# EAGLE design NervousSys_V2 (EAGLE 8.6.0)
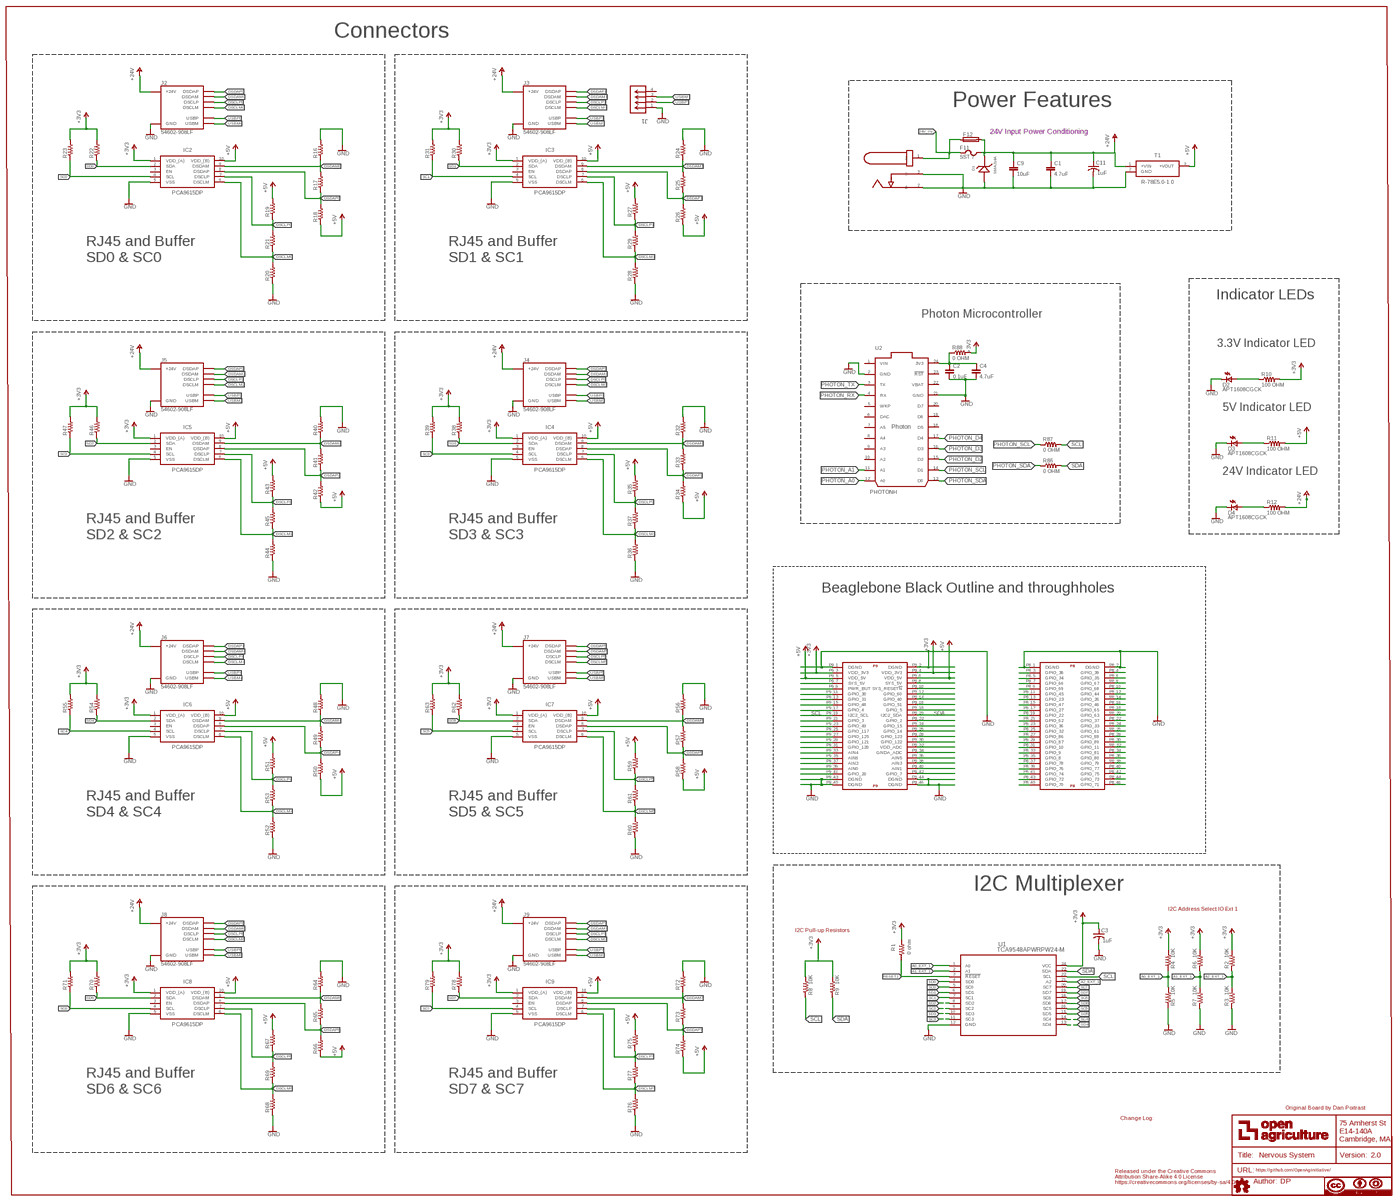
[diagram p0: schematic, sheet 1, overview]
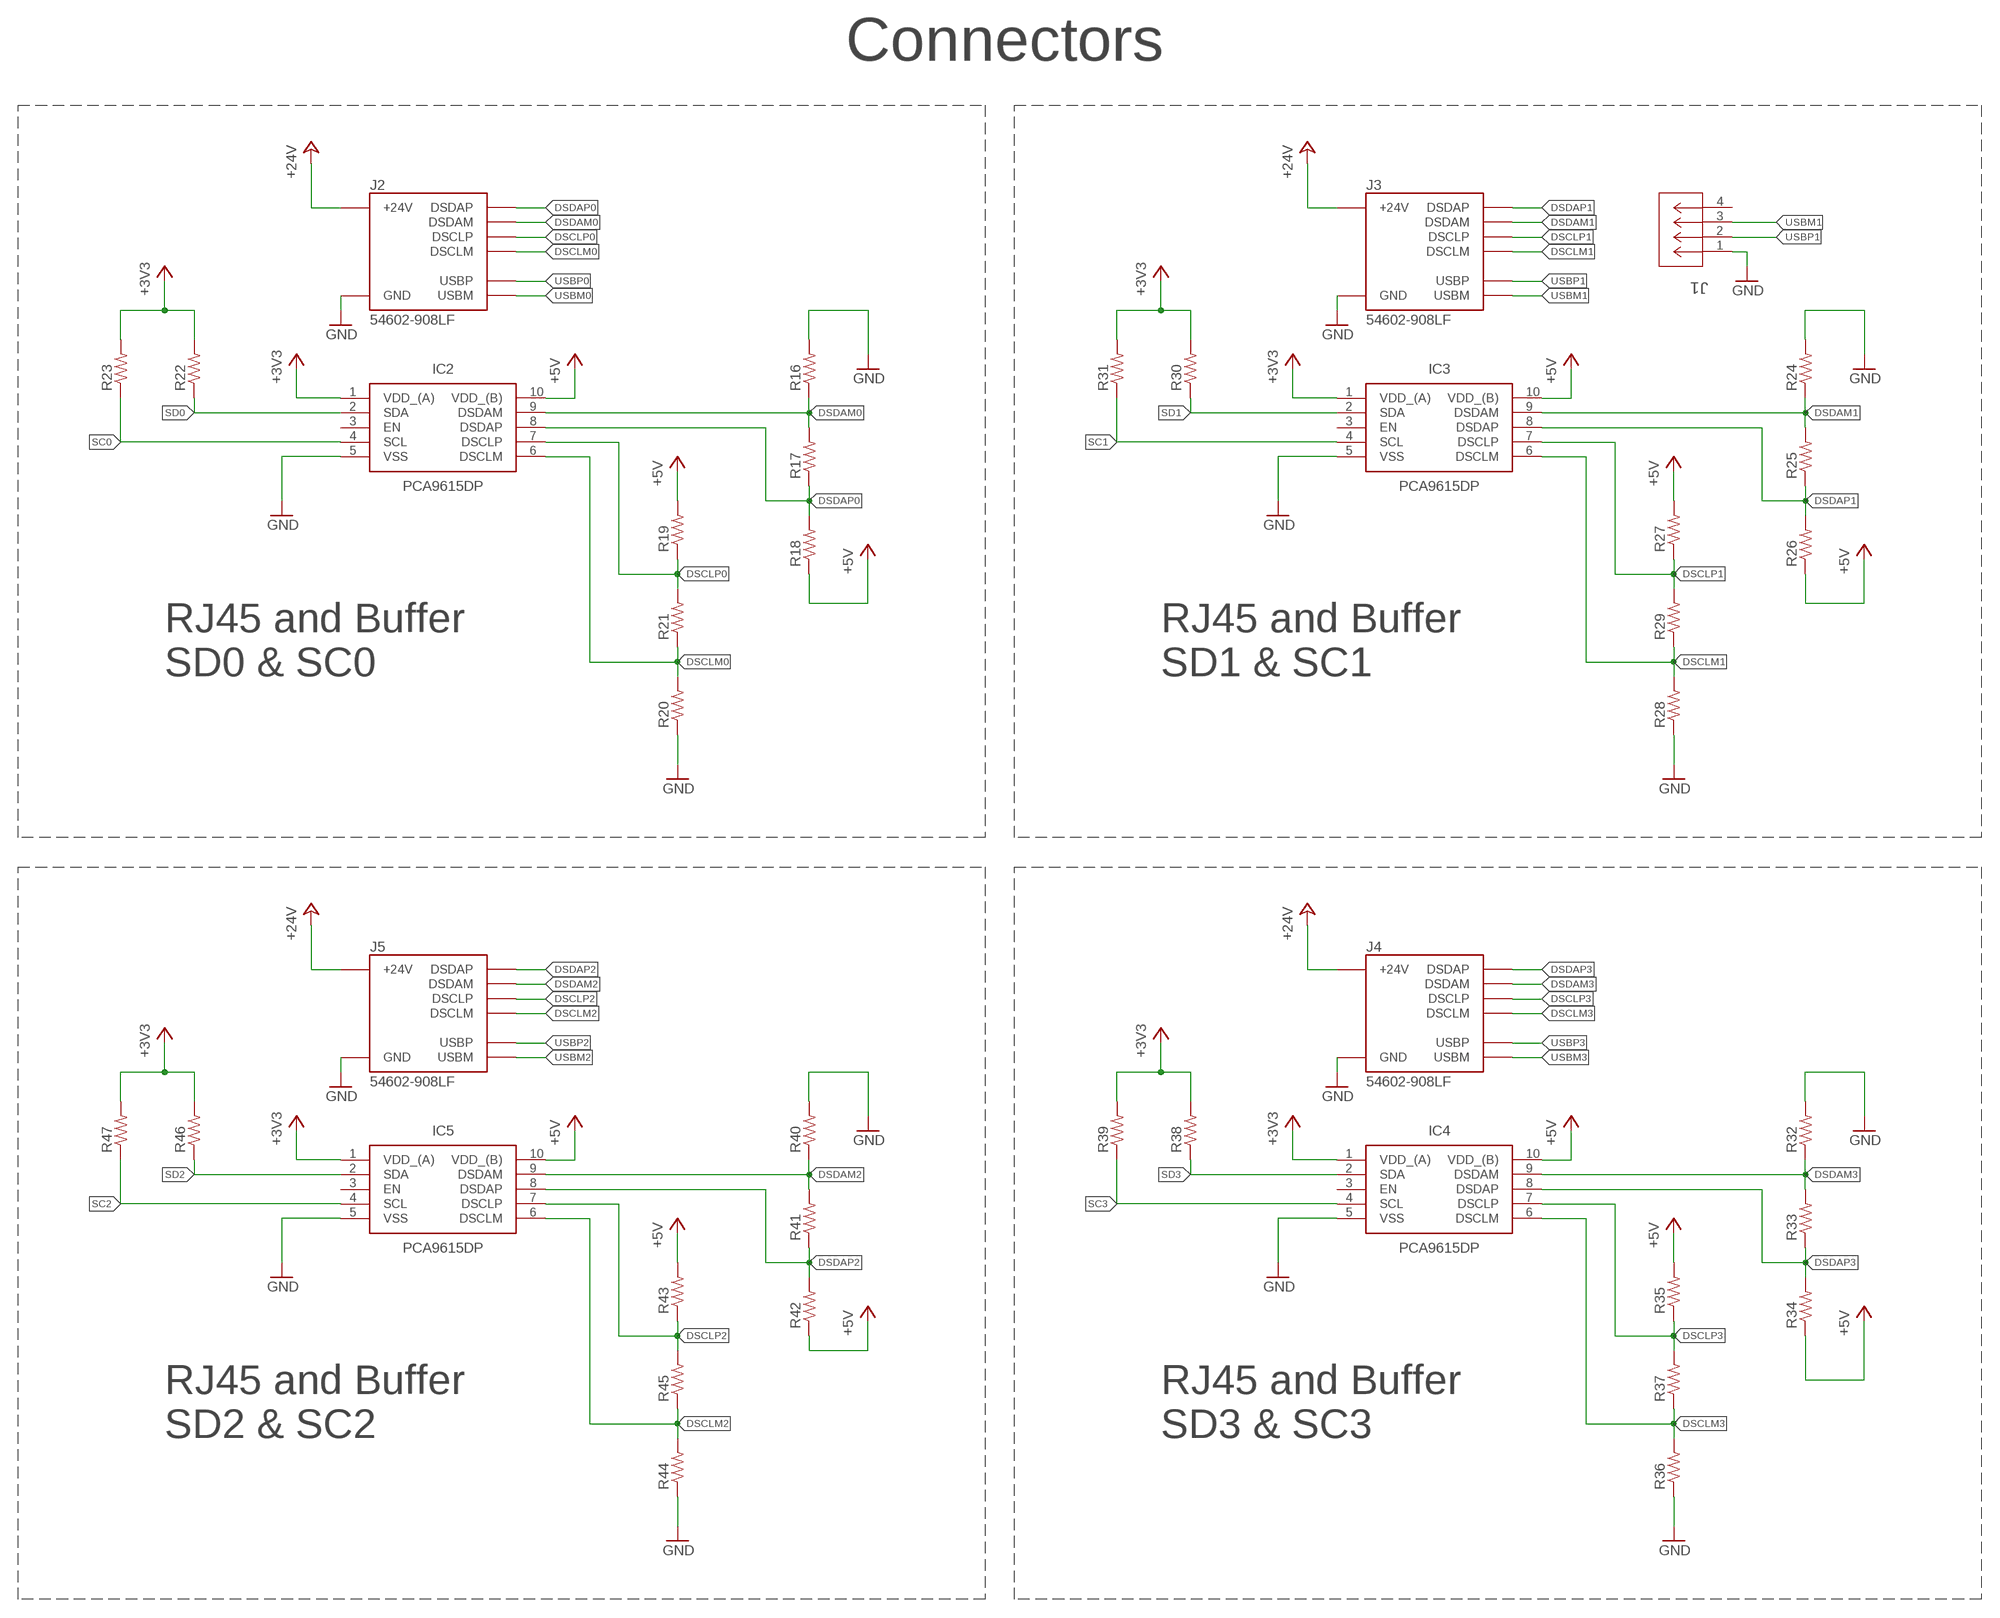
[diagram p1: schematic, sheet 1, part 1 of 4]
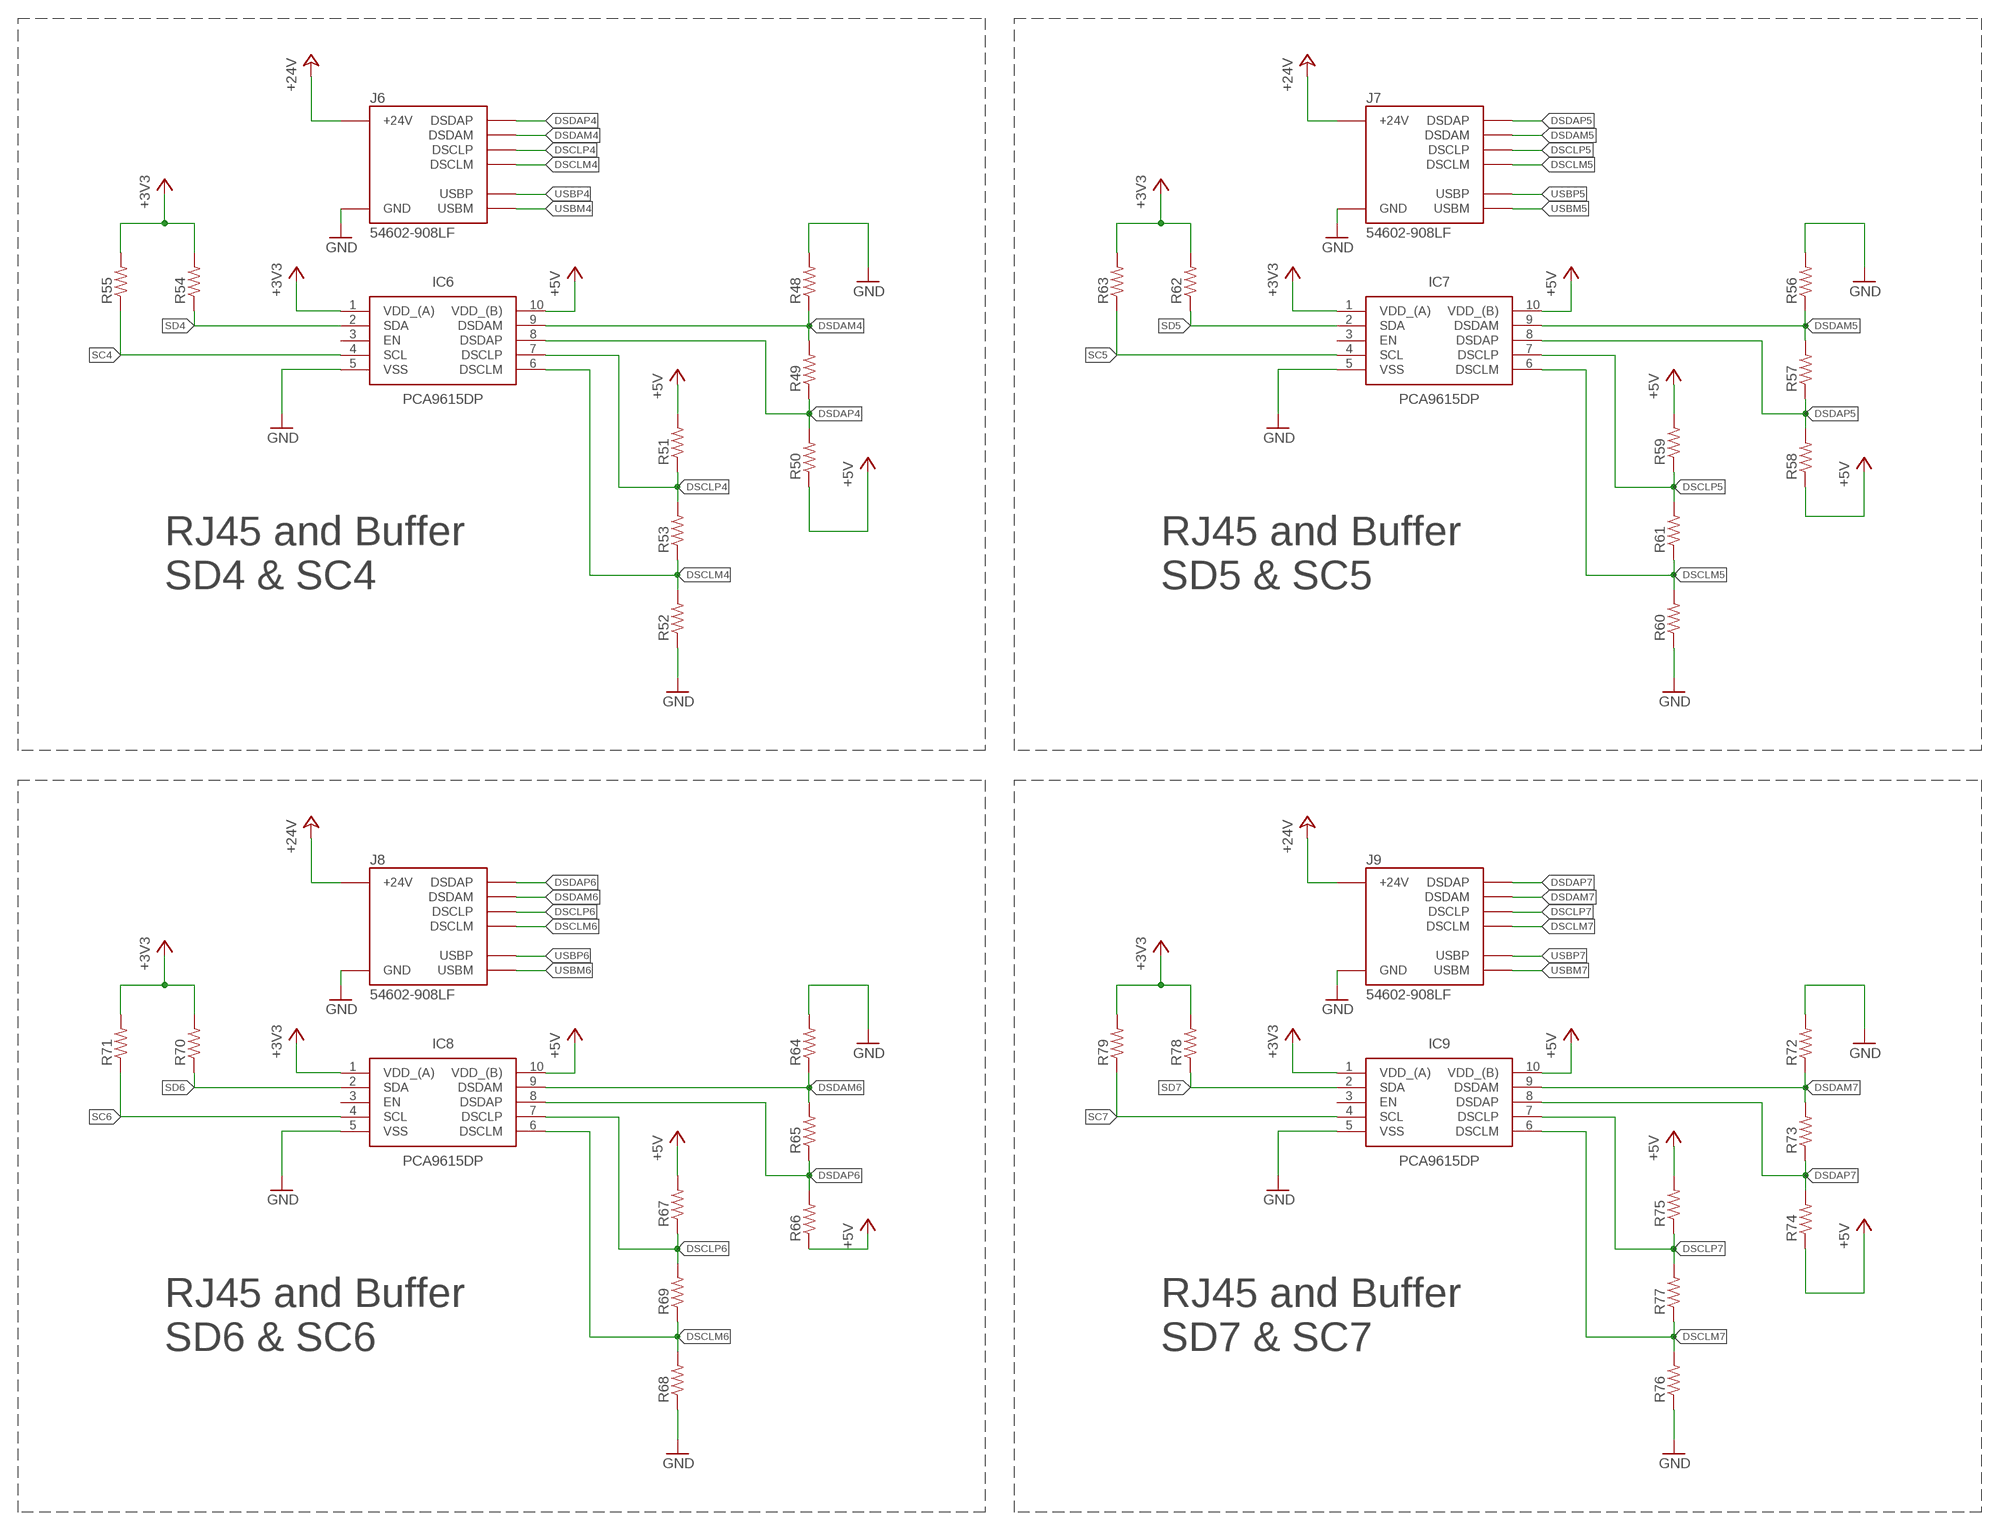
[diagram p2: schematic, sheet 1, part 2 of 4]
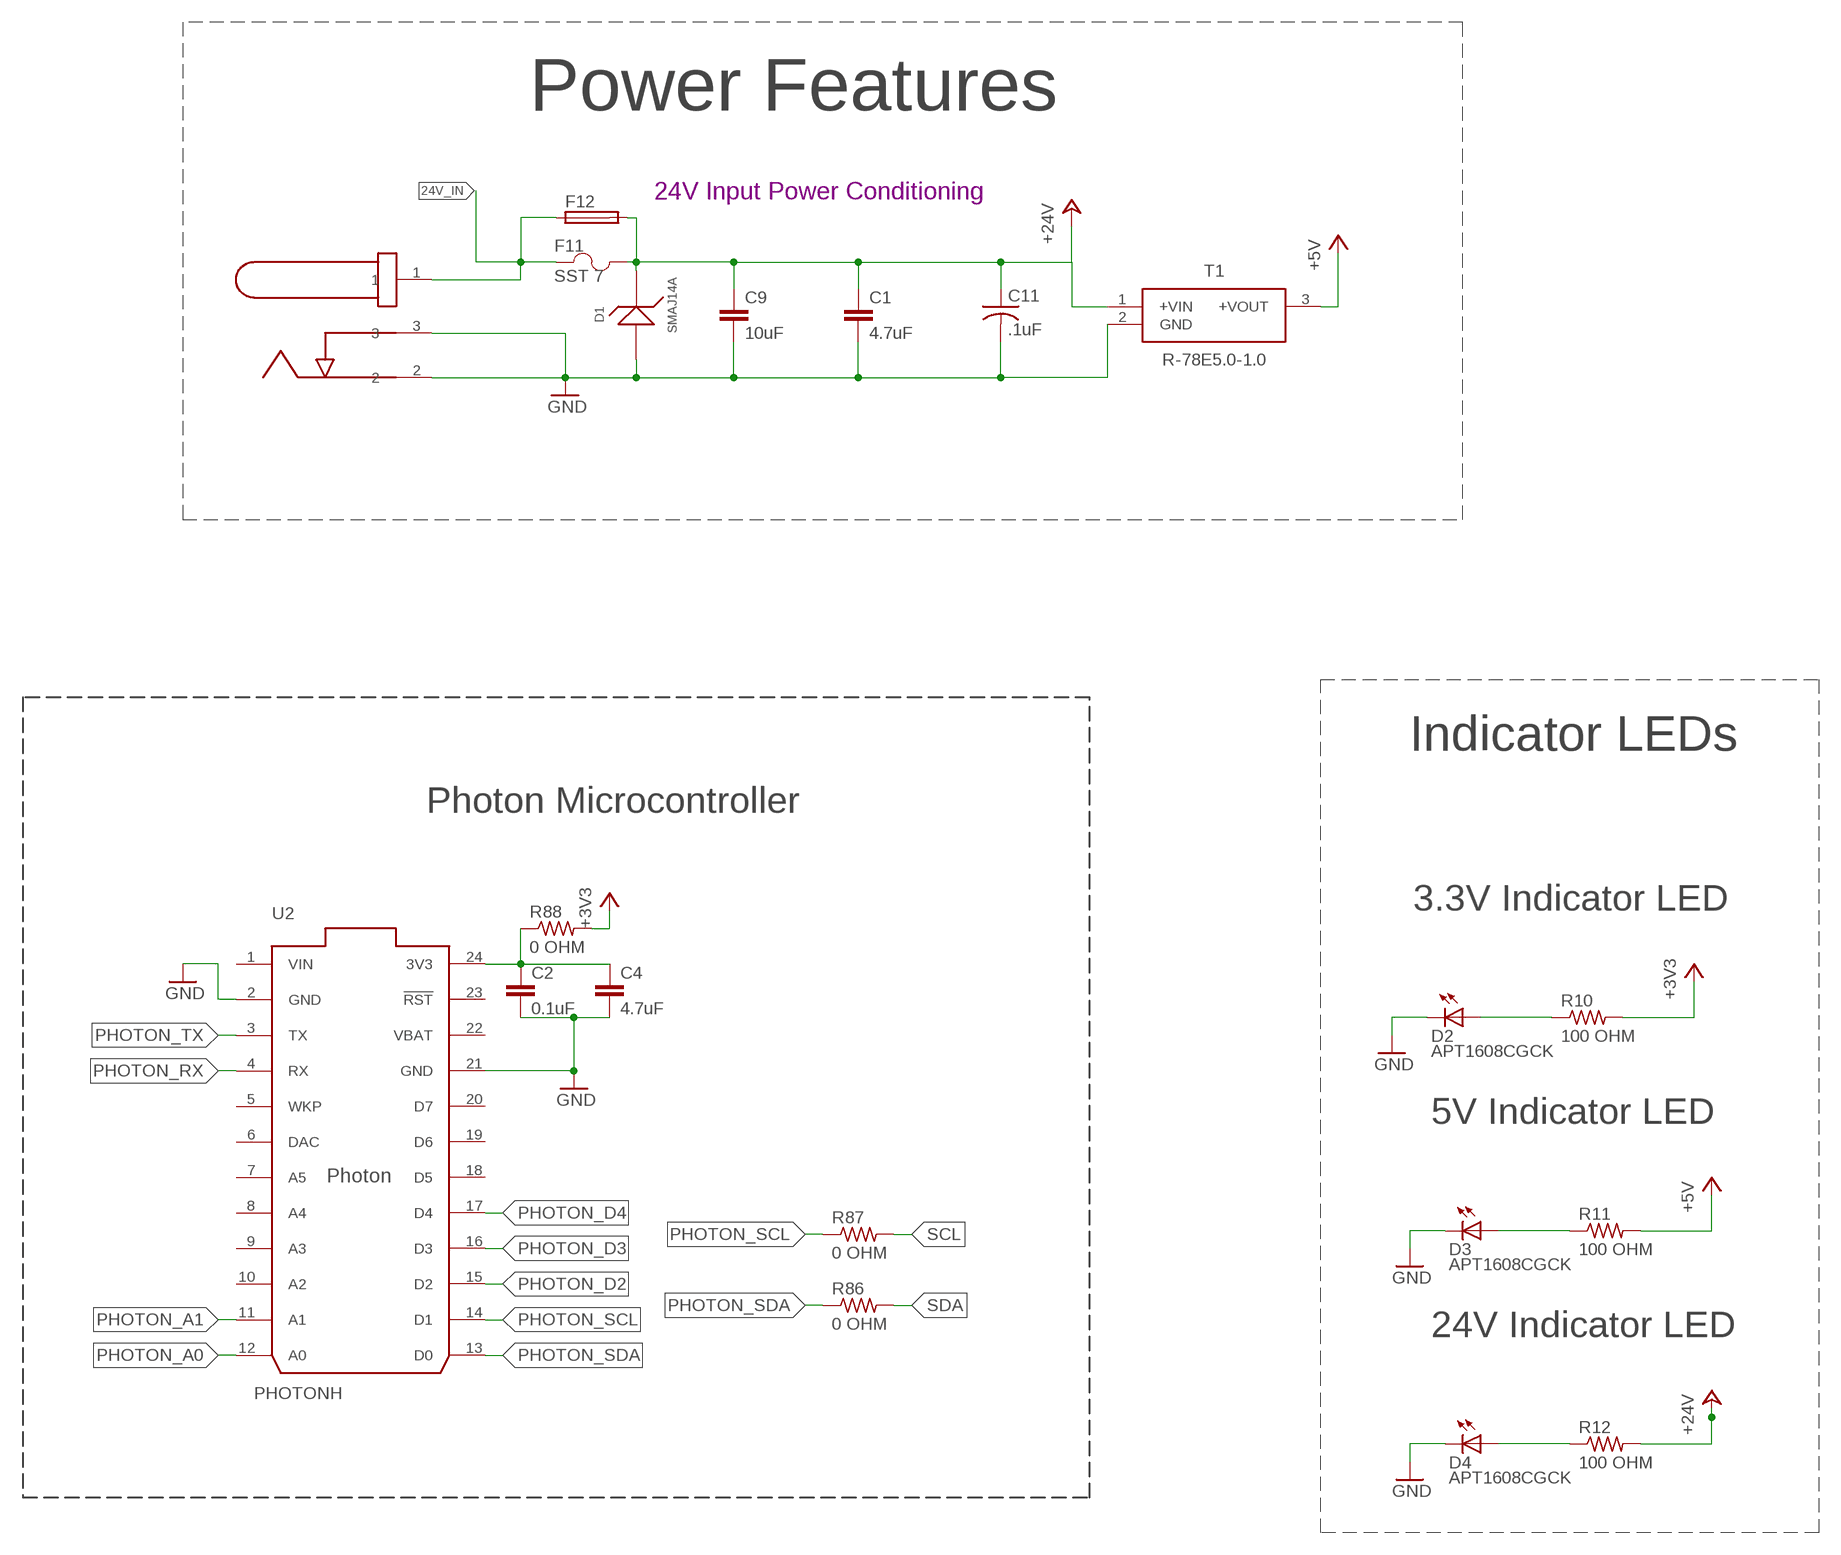
[diagram p3: schematic, sheet 1, part 3 of 4]
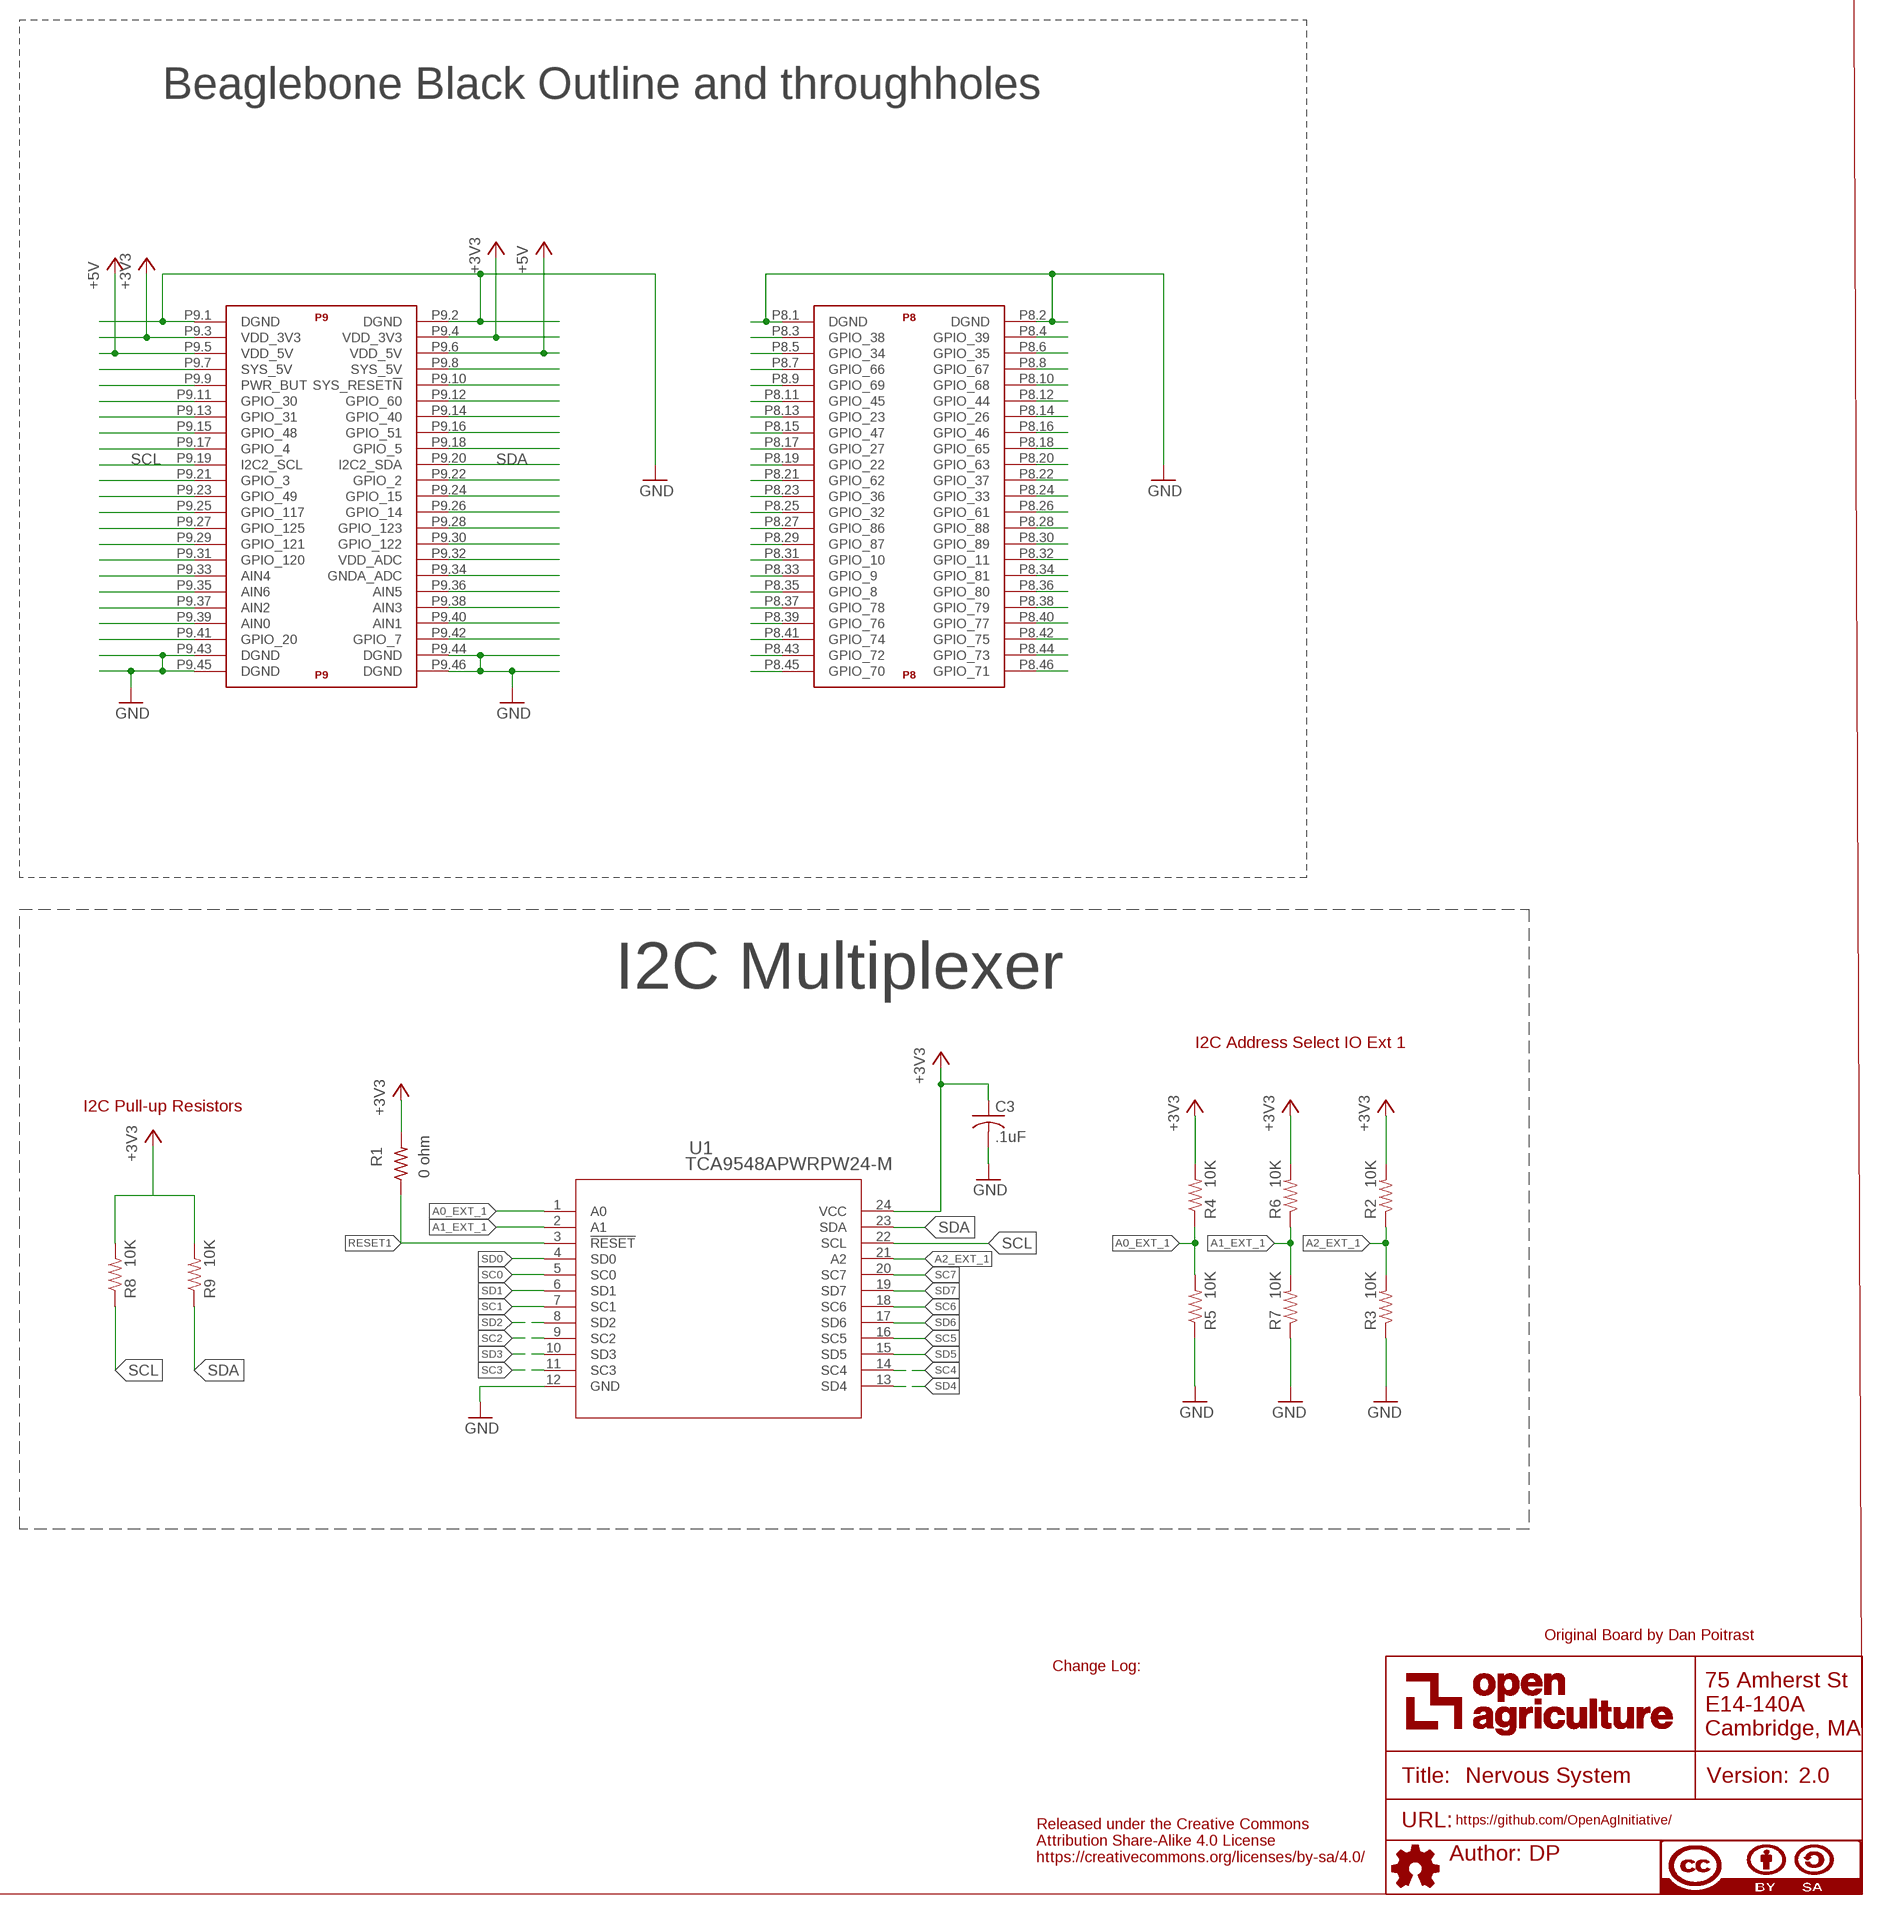
[diagram p4: schematic, sheet 1, part 4 of 4]

## Parts
ATTRIBUTES  DOCFIELD  [DOCFIELD]
C1  4.7uF  4.7UF-C1206C475K5PACTU  [CAP_C1206]
C2  0.1uF  0.1UF-C0603C104K5RACTU  [C0603]
C3  .1uF  C-USC0603  [C0603@1]
C4  4.7uF  4.7UF-CL21A475KBQNNNE  [C0805]
C9  10uF  10UF-CL31B106KBHNNNE  [C1206]
C11  .1uF  C-USC0603  [C0603@1]
D1  SMAJ14A  [DO-214AC]
D2  APT1608CGCK  [CHIPLED_0603]
D3  APT1608CGCK  [CHIPLED_0603]
D4  APT1608CGCK  [CHIPLED_0603]
F11  SST 7  SST_7  [SS]
F12  GSH15  [GSH15]
IC2  PCA9615DP  [SOP50P490X110-10N]
IC3  PCA9615DP  [SOP50P490X110-10N]
IC4  PCA9615DP  [SOP50P490X110-10N]
IC5  PCA9615DP  [SOP50P490X110-10N]
IC6  PCA9615DP  [SOP50P490X110-10N]
IC7  PCA9615DP  [SOP50P490X110-10N]
IC8  PCA9615DP  [SOP50P490X110-10N]
IC9  PCA9615DP  [SOP50P490X110-10N]
J1  87583-2010BLF  [CONN_USB-87583]
J2  54602-908LF  OPENAG-V1-RJ45PTH  [OPENAG-V1-RJ45]
J3  54602-908LF  OPENAG-V1-RJ45PTH  [OPENAG-V1-RJ45]
J4  54602-908LF  OPENAG-V1-RJ45PTH  [OPENAG-V1-RJ45]
J5  54602-908LF  OPENAG-V1-RJ45PTH  [OPENAG-V1-RJ45]
J6  54602-908LF  OPENAG-V1-RJ45PTH  [OPENAG-V1-RJ45]
J7  54602-908LF  OPENAG-V1-RJ45PTH  [OPENAG-V1-RJ45]
J8  54602-908LF  OPENAG-V1-RJ45PTH  [OPENAG-V1-RJ45]
J9  54602-908LF  OPENAG-V1-RJ45PTH  [OPENAG-V1-RJ45]
R1  0 ohm  R-US_R0603  [R0603]
R2  10K  10KOHM-1/10W-1%(0603)0603  [0603-RES]
R3  10K  10KOHM-1/10W-1%(0603)0603  [0603-RES]
R4  10K  10KOHM-1/10W-1%(0603)0603  [0603-RES]
R5  10K  10KOHM-1/10W-1%(0603)0603  [0603-RES]
R6  10K  10KOHM-1/10W-1%(0603)0603  [0603-RES]
R7  10K  10KOHM-1/10W-1%(0603)0603  [0603-RES]
R8  10K  10KOHM-1/10W-1%(0603)0603  [0603-RES]
R9  10K  10KOHM-1/10W-1%(0603)0603  [0603-RES]
R10  100 OHM  100OHM-RC0603JR-07100RL  [RC0603N]
R11  100 OHM  100OHM-RC0603JR-07100RL  [RC0603N]
R12  100 OHM  100OHM-RC0603JR-07100RL  [RC0603N]
R16  R-US_R0603  [R0603]
R17  R-US_R0603  [R0603]
R18  R-US_R0603  [R0603]
R19  R-US_R0603  [R0603]
R20  R-US_R0603  [R0603]
R21  R-US_R0603  [R0603]
R22  R-US_R0603  [R0603]
R23  R-US_R0603  [R0603]
R24  R-US_R0603  [R0603]
R25  R-US_R0603  [R0603]
R26  R-US_R0603  [R0603]
R27  R-US_R0603  [R0603]
R28  R-US_R0603  [R0603]
R29  R-US_R0603  [R0603]
R30  R-US_R0603  [R0603]
R31  R-US_R0603  [R0603]
R32  R-US_R0603  [R0603]
R33  R-US_R0603  [R0603]
R34  R-US_R0603  [R0603]
R35  R-US_R0603  [R0603]
R36  R-US_R0603  [R0603]
R37  R-US_R0603  [R0603]
R38  R-US_R0603  [R0603]
R39  R-US_R0603  [R0603]
R40  R-US_R0603  [R0603]
R41  R-US_R0603  [R0603]
R42  R-US_R0603  [R0603]
R43  R-US_R0603  [R0603]
R44  R-US_R0603  [R0603]
R45  R-US_R0603  [R0603]
R46  R-US_R0603  [R0603]
R47  R-US_R0603  [R0603]
R48  R-US_R0603  [R0603]
R49  R-US_R0603  [R0603]
R50  R-US_R0603  [R0603]
R51  R-US_R0603  [R0603]
R52  R-US_R0603  [R0603]
R53  R-US_R0603  [R0603]
R54  R-US_R0603  [R0603]
R55  R-US_R0603  [R0603]
R56  R-US_R0603  [R0603]
R57  R-US_R0603  [R0603]
R58  R-US_R0603  [R0603]
R59  R-US_R0603  [R0603]
R60  R-US_R0603  [R0603]
R61  R-US_R0603  [R0603]
R62  R-US_R0603  [R0603]
R63  R-US_R0603  [R0603]
R64  R-US_R0603  [R0603]
R65  R-US_R0603  [R0603]
R66  R-US_R0603  [R0603]
R67  R-US_R0603  [R0603]
R68  R-US_R0603  [R0603]
R69  R-US_R0603  [R0603]
R70  R-US_R0603  [R0603]
R71  R-US_R0603  [R0603]
R72  R-US_R0603  [R0603]
R73  R-US_R0603  [R0603]
R74  R-US_R0603  [R0603]
R75  R-US_R0603  [R0603]
R76  R-US_R0603  [R0603]
R77  R-US_R0603  [R0603]
R78  R-US_R0603  [R0603]
R79  R-US_R0603  [R0603]
R86  0 OHM  0OHM-RC0603JR-070RL  [RC0603N]
R87  0 OHM  0OHM-RC0603JR-070RL  [RC0603N]
R88  0 OHM  0OHM-RC0603JR-070RL  [RC0603N]
T1  R-78E5.0-1.0  [R-78E5.0-1.0]
U1  TCA9548APWRPW24-M  [PW24-M]
U2  PHOTONH  PHOTONHPHOTONH  [PHOTON]
U$1  PJ-036AH  [PJ-036AH]
U$2  BEAGLE_BONE_BLACK_CAPE  [BEAGLE_BONE_BLACK_CAPE]

## Nets
24V_IN: F11.1 F12.1 U$1.1
+3V3: C3.1 IC2.1(VDD_(A)) IC3.1(VDD_(A)) IC4.1(VDD_(A)) IC5.1(VDD_(A)) IC6.1(VDD_(A)) IC7.1(VDD_(A)) IC8.1(VDD_(A)) IC9.1(VDD_(A)) R1.2 R2.2 R4.2 R6.2 R8.2 R9.2 R10.2 R22.2 R23.2 R30.2 R31.2 R38.2 R39.2 R46.2 R47.2 R54.2 R55.2 R62.2 R63.2 R70.2 R71.2 R78.2 R79.2 R88.2 U1.24(VCC) U$2.P9.3(P9:VDD_3V3) U$2.P9.4(P9:VDD_3V3)
+5V: IC2.10(VDD_(B)) IC3.10(VDD_(B)) IC4.10(VDD_(B)) IC5.10(VDD_(B)) IC6.10(VDD_(B)) IC7.10(VDD_(B)) IC8.10(VDD_(B)) IC9.10(VDD_(B)) R11.2 R18.1 R19.2 R26.1 R27.2 R34.1 R35.2 R42.1 R43.2 R50.1 R51.2 R58.1 R59.2 R66.1 R67.2 R74.1 R75.2 T1.3(+VOUT) U$2.P9.5(P9:VDD_5V) U$2.P9.6(P9:VDD_5V)
+24V: C1.1 C9.1 C11.1 D1.C F11.2 F12.2 J2.24V(6)(+24V) J3.24V(6)(+24V) J4.24V(6)(+24V) J5.24V(6)(+24V) J6.24V(6)(+24V) J7.24V(6)(+24V) J8.24V(6)(+24V) J9.24V(6)(+24V) R12.2 T1.1(+VIN)
A0_EXT_1: R4.1 R5.2 U1.1(A0)
A1_EXT_1: R6.1 R7.2 U1.2(A1)
A2_EXT_1: R2.1 R3.2 U1.21(A2)
DSCLM0: IC2.6(DSCLM) J2.DSCLM(5)(DSCLM) R20.2 R21.1
DSCLM1: IC3.6(DSCLM) J3.DSCLM(5)(DSCLM) R28.2 R29.1
DSCLM2: IC5.6(DSCLM) J5.DSCLM(5)(DSCLM) R44.2 R45.1
DSCLM3: IC4.6(DSCLM) J4.DSCLM(5)(DSCLM) R36.2 R37.1
DSCLM4: IC6.6(DSCLM) J6.DSCLM(5)(DSCLM) R52.2 R53.1
DSCLM5: IC7.6(DSCLM) J7.DSCLM(5)(DSCLM) R60.2 R61.1
DSCLM6: IC8.6(DSCLM) J8.DSCLM(5)(DSCLM) R68.2 R69.1
DSCLM7: IC9.6(DSCLM) J9.DSCLM(5)(DSCLM) R76.2 R77.1
DSCLP0: IC2.7(DSCLP) J2.DSCLP(4)(DSCLP) R19.1 R21.2
DSCLP1: IC3.7(DSCLP) J3.DSCLP(4)(DSCLP) R27.1 R29.2
DSCLP2: IC5.7(DSCLP) J5.DSCLP(4)(DSCLP) R43.1 R45.2
DSCLP3: IC4.7(DSCLP) J4.DSCLP(4)(DSCLP) R35.1 R37.2
DSCLP4: IC6.7(DSCLP) J6.DSCLP(4)(DSCLP) R51.1 R53.2
DSCLP5: IC7.7(DSCLP) J7.DSCLP(4)(DSCLP) R59.1 R61.2
DSCLP6: IC8.7(DSCLP) J8.DSCLP(4)(DSCLP) R67.1 R69.2
DSCLP7: IC9.7(DSCLP) J9.DSCLP(4)(DSCLP) R75.1 R77.2
DSDAM0: IC2.9(DSDAM) J2.DSDAM(2)(DSDAM) R16.1 R17.2
DSDAM1: IC3.9(DSDAM) J3.DSDAM(2)(DSDAM) R24.1 R25.2
DSDAM2: IC5.9(DSDAM) J5.DSDAM(2)(DSDAM) R40.1 R41.2
DSDAM3: IC4.9(DSDAM) J4.DSDAM(2)(DSDAM) R32.1 R33.2
DSDAM4: IC6.9(DSDAM) J6.DSDAM(2)(DSDAM) R48.1 R49.2
DSDAM5: IC7.9(DSDAM) J7.DSDAM(2)(DSDAM) R56.1 R57.2
DSDAM6: IC8.9(DSDAM) J8.DSDAM(2)(DSDAM) R64.1 R65.2
DSDAM7: IC9.9(DSDAM) J9.DSDAM(2)(DSDAM) R72.1 R73.2
DSDAP0: IC2.8(DSDAP) J2.DSDAP(1)(DSDAP) R17.1 R18.2
DSDAP1: IC3.8(DSDAP) J3.DSDAP(1)(DSDAP) R25.1 R26.2
DSDAP2: IC5.8(DSDAP) J5.DSDAP(1)(DSDAP) R41.1 R42.2
DSDAP3: IC4.8(DSDAP) J4.DSDAP(1)(DSDAP) R33.1 R34.2
DSDAP4: IC6.8(DSDAP) J6.DSDAP(1)(DSDAP) R49.1 R50.2
DSDAP5: IC7.8(DSDAP) J7.DSDAP(1)(DSDAP) R57.1 R58.2
DSDAP6: IC8.8(DSDAP) J8.DSDAP(1)(DSDAP) R65.1 R66.2
DSDAP7: IC9.8(DSDAP) J9.DSDAP(1)(DSDAP) R73.1 R74.2
GND: C1.2 C2.2 C3.2 C4.2 C9.2 C11.2 D1.A D2.C D3.C D4.C IC2.5(VSS) IC3.5(VSS) IC4.5(VSS) IC5.5(VSS) IC6.5(VSS) IC7.5(VSS) IC8.5(VSS) IC9.5(VSS) J1.1 J2.GND(3)(GND) J3.GND(3)(GND) J4.GND(3)(GND) J5.GND(3)(GND) J6.GND(3)(GND) J7.GND(3)(GND) J8.GND(3)(GND) J9.GND(3)(GND) R3.1 R5.1 R7.1 R16.2 R20.1 R24.2 R28.1 R32.2 R36.1 R40.2 R44.1 R48.2 R52.1 R56.2 R60.1 R64.2 R68.1 R72.2 R76.1 T1.2(GND) U1.12(GND) U2.2(GND) U2.21(GND) U$1.2 U$1.3 U$2.P8.1(P8:DGND) U$2.P8.2(P8:DGND) U$2.P9.1(P9:DGND) U$2.P9.2(P9:DGND) U$2.P9.43(P9:DGND) U$2.P9.44(P9:DGND) U$2.P9.45(P9:DGND) U$2.P9.46(P9:DGND)
N$1: U$2.P8.45(P8:GPIO_70)
N$2: D3.A R11.1
N$3: U$2.P8.43(P8:GPIO_72)
N$4: D4.A R12.1
N$6: U$2.P8.41(P8:GPIO_74)
N$7: U$2.P8.39(P8:GPIO_76)
N$8: U$2.P8.37(P8:GPIO_78)
N$9: C2.1 C4.1 R88.1 U2.24(3V3)
N$10: U$2.P8.35(P8:GPIO_8)
N$11: U$2.P8.33(P8:GPIO_9)
N$12: D2.A R10.1
N$30: U$2.P8.31(P8:GPIO_10)
N$53: U$2.P8.29(P8:GPIO_87)
N$54: U$2.P8.27(P8:GPIO_86)
N$55: U$2.P8.25(P8:GPIO_32)
N$67: U$2.P8.23(P8:GPIO_36)
N$74: U$2.P8.21(P8:GPIO_62)
N$75: U$2.P8.19(P8:GPIO_22)
N$76: U$2.P8.17(P8:GPIO_27)
N$77: U$2.P8.15(P8:GPIO_47)
N$78: U$2.P8.13(P8:GPIO_23)
N$90: U$2.P8.11(P8:GPIO_45)
N$97: U$2.P8.9(P8:GPIO_69)
N$98: U$2.P8.7(P8:GPIO_66)
N$99: U$2.P8.5(P8:GPIO_34)
N$100: U$2.P8.3(P8:GPIO_38)
N$101: U$2.P8.46(P8:GPIO_71)
N$102: U$2.P8.44(P8:GPIO_73)
N$103: U$2.P8.42(P8:GPIO_75)
N$104: U$2.P8.40(P8:GPIO_77)
N$105: U$2.P8.38(P8:GPIO_79)
N$106: U$2.P8.36(P8:GPIO_80)
N$107: U$2.P8.34(P8:GPIO_81)
N$108: U$2.P8.32(P8:GPIO_11)
N$109: U$2.P8.30(P8:GPIO_89)
N$110: U$2.P8.28(P8:GPIO_88)
N$111: U$2.P8.26(P8:GPIO_61)
N$112: U$2.P8.24(P8:GPIO_33)
N$113: U$2.P8.22(P8:GPIO_37)
N$114: U$2.P8.20(P8:GPIO_63)
N$115: U$2.P8.18(P8:GPIO_65)
N$116: U$2.P8.16(P8:GPIO_46)
N$117: U$2.P8.14(P8:GPIO_26)
N$118: U$2.P8.12(P8:GPIO_44)
N$119: U$2.P8.10(P8:GPIO_68)
N$120: U$2.P8.8(P8:GPIO_67)
N$121: U$2.P8.6(P8:GPIO_35)
N$122: U$2.P8.4(P8:GPIO_39)
N$123: U$2.P9.42(P9:GPIO_7)
N$124: U$2.P9.40(P9:AIN1)
N$125: U$2.P9.38(P9:AIN3)
N$126: U$2.P9.36(P9:AIN5)
N$127: U$2.P9.34(P9:GNDA_ADC)
N$128: U$2.P9.32(P9:VDD_ADC)
N$129: U$2.P9.30(P9:GPIO_122)
N$130: U$2.P9.28(P9:GPIO_123)
N$131: U$2.P9.26(P9:GPIO_14)
N$132: U$2.P9.24(P9:GPIO_15)
N$133: U$2.P9.22(P9:GPIO_2)
N$134: U$2.P9.18(P9:GPIO_5)
N$135: U$2.P9.16(P9:GPIO_51)
N$136: U$2.P9.14(P9:GPIO_40)
N$137: U$2.P9.12(P9:GPIO_60)
N$138: U$2.P9.10(P9:SYS_RESET!N)
N$139: U$2.P9.8(P9:SYS_5V)
N$140: U$2.P9.41(P9:GPIO_20)
N$141: U$2.P9.39(P9:AIN0)
N$142: U$2.P9.37(P9:AIN2)
N$143: U$2.P9.35(P9:AIN6)
N$144: U$2.P9.33(P9:AIN4)
N$145: U$2.P9.31(P9:GPIO_120)
N$146: U$2.P9.29(P9:GPIO_121)
N$147: U$2.P9.27(P9:GPIO_125)
N$148: U$2.P9.25(P9:GPIO_117)
N$149: U$2.P9.23(P9:GPIO_49)
N$150: U$2.P9.21(P9:GPIO_3)
N$151: U$2.P9.17(P9:GPIO_4)
N$152: U$2.P9.15(P9:GPIO_48)
N$153: U$2.P9.13(P9:GPIO_31)
N$154: U$2.P9.11(P9:GPIO_30)
N$155: U$2.P9.9(P9:PWR_BUT)
N$156: U$2.P9.7(P9:SYS_5V)
PHOTON_A0: U2.12(A0)
PHOTON_A1: U2.11(A1)
PHOTON_D2: U2.15(D2)
PHOTON_D3: U2.16(D3)
PHOTON_D4: U2.17(D4)
PHOTON_RX: U2.4(RX)
PHOTON_SCL: R87.1 U2.14(D1)
PHOTON_SDA: R86.1 U2.13(D0)
PHOTON_TX: U2.3(TX)
RESET1: R1.1 U1.3(!RESET)
SC0: IC2.4(SCL) R23.1 U1.5(SC0)
SC1: IC3.4(SCL) R31.1 U1.7(SC1)
SC2: IC5.4(SCL) R47.1 U1.9(SC2)
SC3: IC4.4(SCL) R39.1 U1.11(SC3)
SC4: IC6.4(SCL) R55.1 U1.14(SC4)
SC5: IC7.4(SCL) R63.1 U1.16(SC5)
SC6: IC8.4(SCL) R71.1 U1.18(SC6)
SC7: IC9.4(SCL) R79.1 U1.20(SC7)
SCL: R8.1 R87.2 U1.22(SCL) U$2.P9.19(P9:I2C2_SCL)
SD0: IC2.2(SDA) R22.1 U1.4(SD0)
SD1: IC3.2(SDA) R30.1 U1.6(SD1)
SD2: IC5.2(SDA) R46.1 U1.8(SD2)
SD3: IC4.2(SDA) R38.1 U1.10(SD3)
SD4: IC6.2(SDA) R54.1 U1.13(SD4)
SD5: IC7.2(SDA) R62.1 U1.15(SD5)
SD6: IC8.2(SDA) R70.1 U1.17(SD6)
SD7: IC9.2(SDA) R78.1 U1.19(SD7)
SDA: R9.1 R86.2 U1.23(SDA) U$2.P9.20(P9:I2C2_SDA)
USBM0: J2.USBM(8)(USBM)
USBM1: J1.3 J3.USBM(8)(USBM)
USBM2: J5.USBM(8)(USBM)
USBM3: J4.USBM(8)(USBM)
USBM4: J6.USBM(8)(USBM)
USBM5: J7.USBM(8)(USBM)
USBM6: J8.USBM(8)(USBM)
USBM7: J9.USBM(8)(USBM)
USBP0: J2.USBP(7)(USBP)
USBP1: J1.2 J3.USBP(7)(USBP)
USBP2: J5.USBP(7)(USBP)
USBP3: J4.USBP(7)(USBP)
USBP4: J6.USBP(7)(USBP)
USBP5: J7.USBP(7)(USBP)
USBP6: J8.USBP(7)(USBP)
USBP7: J9.USBP(7)(USBP)
Unconnected: IC2.3(EN) IC3.3(EN) IC4.3(EN) IC5.3(EN) IC6.3(EN) IC7.3(EN) IC8.3(EN) IC9.3(EN) J1.4 U2.5(WKP) U2.6(DAC) U2.7(A5) U2.8(A4) U2.9(A3) U2.10(A2) U2.18(D5) U2.19(D6) U2.20(D7) U2.23(!RST)

## Notes on the sheet
- Connectors
- Power Features
- 24V Input Power Conditioning
- RJ45 and Buffer
  SD0 & SC0
- RJ45 and Buffer
  SD1 & SC1
- Indicator LEDs
- Photon Microcontroller
- 3.3V Indicator LED
- 5V Indicator LED
- 24V Indicator LED
- RJ45 and Buffer
  SD2 & SC2
- RJ45 and Buffer
  SD3 & SC3
- Beaglebone Black Outline and throughholes
- RJ45 and Buffer
  SD4 & SC4
- RJ45 and Buffer
  SD5 & SC5
- I2C Multiplexer
- I2C Address Select IO Ext 1
- I2C Pull-up Resistors
- RJ45 and Buffer
  SD6 & SC6
- RJ45 and Buffer
  SD7 & SC7
- Original Board by Dan Poitrast
- Change Log:
- Released under the Creative Commons
  Attribution Share-Alike 4.0 License
  https://creativecommons.org/licenses/by-sa/4.0/

## Power pins joined to a net without a drawn wire
VBAT: U2.22(VBAT)
VIN: U2.1(VIN)

## Library data of the parts
ATTRIBUTES = openag-frames:DOCFIELD: DOCUMENT FIELD; AUTHOR: DP; DESCRIPTION: Nervous System; TITLE: Nervous System; URL: https://github.com/OpenAgInitiative/; VER: 2.0
C1 = openag-capacitors:4.7UF-C1206C475K5PACTU: Kemet - C1206C475K5PACTU - CAP CER 4.7UF 50V X5R 1206 Description: 4.7�F �10% 50V Ceramic Capacitor X5R 1206 (3216 Metric) Technical Specifications: Capacitance: 4.7uF Tolerance: ±10% Rated Voltage: 50V Temperature Coefficient: X5R Operating Temperature: -55°C ~ 85°C Package/Case: 1206 (3216 Metric) Datasheet(s): https://media.digikey.com/pdf/Data%20Sheets/Kemet%20PDFs/C1206C475K5PAC.pdf Vendor(s): Digikey: 399-5507-1-ND <https://www.digikey.com/product-detail/en/kemet/C1206C475K5PACTU/399-5507-1-ND/1950685>; POPULATE: YES; VERIFIED: NO
C2 = openag-capacitors:0.1UF-C0603C104K5RACTU: Kemet - C0603C104K5RACTU - CAP CER 0.1UF 50V X7R 0603 Description: 0.1µF ±10% 50V Ceramic Capacitor X7R 0603 (1608 Metric) Technical Specifications: Capacitance: 0.1µF Tolerance: ±10% Rated Voltage: 50V Temperature Coefficient: X7R Operating Temperature: -55°C ~ 125°C Package / Case: 0603 (1608 Metric) Datasheet(s): X7R Dielectric, 6.3-250 VDC <https://search.kemet.com/component-edge/download/datasheet/C0603C104K5RACTU.pdf> Vendor(s): Digikey: 399-5089-1-ND <https://www.digikey.com/product-detail/en/kemet/C0603C104K5RACTU/399-5089-1-ND/1465623>; POPULATE: YES; VERIFIED: NO
C3 C11 = rcl:C-US: CAPACITOR, American symbol
C4 = openag-capacitors:4.7UF-CL21A475KBQNNNE: Samsung - CL21A475KBQNNNE - CAP CER 4.7UF 50V X5R 0805 Description: 4.7µF ±10% 50V Ceramic Capacitor X5R 0805 (2012 Metric) Technical Specifications: Capacitance: 4.7uF Tolerance: ±10% Rated Voltage: 50V Temperature Coefficient: X5R Operating Temperature: -55°C ~ 85°C Package/Case: 0805 (2012 Metric) Datasheet(s): CL21A475KBQNNNE Characteristics <http://www.samsungsem.com/kr/front/downloadcms.do?path=/kr/support/product-search/mlcc/__icsFiles/afieldfile/2014/11/05&fileName=C_CL21A475KBQNNNE.pdf> Vendor(s): Digikey: 1276-1248-1-ND <https://www.digikey.com/product-detail/en/samsung-electro-mechanics/CL21A475KBQNNNE/1276-1248-1-ND/3889334>; POPULATE: YES; VERIFIED: NO
C9 = openag-capacitors:10UF-CL31B106KBHNNNE: Samsung - CL31B106KBHNNNE - CAP CER 10UF 50V X7R 1206 Description: 10�F �10% 50V Ceramic Capacitor X7R 1206 (3216 Metric) Technical Specifications: Capacitance: 10uF Tolerance: ±10% Rated Voltage: 50V Temperature Coefficient: X7R Operating Temperature: -55°C ~ -125°C Package/Case: 1206 (3216 Metric) Datasheet(s): CL Series, MLCC Datasheet <https://media.digikey.com/pdf/Data%20Sheets/Samsung%20PDFs/CL_Series_MLCC_ds.pdf> Vendor(s): Digikey: 1276-6767-1-ND <https://www.digikey.com/product-detail/en/samsung-electro-mechanics-america-inc/CL31B106KBHNNNE/1276-6767-1-ND/5961626>; POPULATE: YES; VERIFIED: NO
D1 = openag-diodes:SMAJ14A: TVS DIODE 14VWM 23.2VC SMA - Littlefuse - SMAJ14A - SMAJ14ALFCT-ND Description: The SMAJ series is designed specifically to protect sensitive electronic equipment from voltage transients induced by lightning and other transient voltage events Technical Specifications: Type: Zener Voltage - Reverse Standoff (Typ): 14V Voltage - Breakdown (Min): 15.6V Voltage - Clamping (Max) @ Ipp: 23.2V Current - Peak Pulse (10/1000�s): 17.2A Operating Temperature: -55�C ~ 150�C (TJ) Mounting Type: Surface Mount Package / Case: DO-214AC, SMA Datasheet(s): SMAJ Series <http://www.littelfuse.com/~/media/electronics/datasheets/tvs_diodes/littelfuse_tvs_diode_smaj_datasheet.pdf.pdf> Vendor(s): Digikey: SMAJ14ALFCT-ND <https://www.digikey.com/product-detail/en/littelfuse-inc/SMAJ14A/SMAJ14ALFCT-ND/762486>; POPULATE: YES; VERIFIED: NO
D2-D4 = openag-diodes:APT1608CGCK: Kingbright - APT1608CGCK - LED GREEN CLEAR 0603 SMD Description: Green 570nm LED Indication - Discrete 2.1V 0603 (1608 Metric) Technical Specifications: Color: Green Lens Color: Colorless Lens Transparency: Clear Millicandela Rating: 50mcd Lens Style/Size: Rectangle with Flat Top, 1.20mm x 0.80mm Voltage - Forward (Vf) (Typ): 2.1V Current - Test: 20mA Viewing Angle: 120° Mounting Type: Surface Mount Wavelength - Dominant: 570nm Wavelength - Peak: 574nm Package / Case: 0603 (1608 Metric) Supplier Device Package: Chip LED Size / Dimension: 1.60mm L x 0.80mm W Height (Max): 0.75mm Datasheet(s): APT1608CGCK <http://www.kingbrightusa.com/images/catalog/SPEC/APT1608CGCK.pdf> Vendor(s): Digikey: 754-1116-1-ND <https://www.digikey.com/product-detail/en/kingbright/APT1608CGCK/754-1116-1-ND/1747833#>; POPULATE: YES; VERIFIED: NO
F11 = openag-fuses:SST_7: Bel Fuse - SST7 - FUSE BRD MNT 7A 125VAC/VDC 2SMD Description: FUSE BRD MNT 7A 125VAC/VDC 2SMD Technical Specifications: Current Rating: 7A Voltage Rating: 125V Fuse Type: Board Mount (Cartridge Style Excluded) Mounting Type: Surface Mount Operating Temperature: -55�C ~ 125�C Datasheet(s): SST Type <https://belfuse.com/resources/StewartConnector/SST.pdf> Vendor(s): Digikey: 507-1072-1-ND <https://www.digikey.com/product-detail/en/bel-fuse-inc/SST-7/507-1072-1-ND/615026>; POPULATE: YES; VERIFIED: NO
F12 = fuse:GSH15: FUSE HOLDER grid 15mm, 19649 Wickmann; MPN: 64900001039; OC_FARNELL: 1271673; OC_NEWARK: 02P0318
IC2-IC9 = PCA9615DP:PCA9615DP: Buffer, ReDriver 2 Channel 400kHz 10-TSSOP Source: Datasheet <http://www.nxp.com/docs/en/data-sheet/PCA9615.pdf>; DESCRIPTION: Buffer, ReDriver 2 Channel 400kHz 10-TSSOP; HEIGHT: 1.1mm; MANUFACTURER_NAME: Nexperia; MANUFACTURER_PART_NUMBER: PCA9615DP; SUPPLIER_NAME: RS
J1 = openag-connectors:87583-2010BLF; MANUFACTURER_PART_NUMBER: 875832010BLF; VENDOR: Amphenol FCI
J2-J9 = openag_connector:OPENAG-V1-RJ45: Amphenol FCI - 54602-908LF - CONN MOD JACK 8P8C R/A UNSHLD Description: Jack Modular Connector 8p8c (RJ45, Ethernet) 90� Angle (Right) Unshielded Cat3 Technical Specifications: Connector Type: Jack Number of Positions/Contacts: 8p8c (RJ45, Ethernet) Number of Ports: 1 Number of Rows: 1 Mounting Type: Through Hole Orientation: 90� Angle (Right) Termination: Solder Shielding: Unshielded Ratings: Cat3 Features: Board Lock LED Color: Does Not Contain LED Tab Direction: Down Contact Material: Copper Alloy Contact Finish: Gold Contact Finish Thickness: 15�in (0.38�m) Housing Material: Polyester, Glass Filled Operating Temperature: -40�C ~ 70�C Datasheet(s): 54601-x04(zzz)WPLF Drawing <http://cdn.amphenol-icc.com/media/wysiwyg/files/drawing/c-bmj-0102.pdf> Vendor(s): Digikey: 609-1046-ND <https://www.digikey.com/product-detail/en/amphenol-fci/54602-908LF/609-1046-ND/1001360>; POPULATE: YES; VERIFIED: NO
R1 R16-R79 = rcl:R-US_: RESISTOR, American symbol; SPICEPREFIX: R
R2-R9 = SparkFun-Resistors:10KOHM-1/10W-1%(0603): RES-00824; PROD_ID: RES-00824
R10-R12 = openag-resistors:100OHM-RC0603JR-07100RL: Yageo - RC0603JR-07100RL - RES SMD 100 OHM 5% 1/10W 0603 Description: 100 Ohms ±5% 0.1W, 1/10W Chip Resistor 0603 (1608 Metric) Moisture Resistant Thick Film Technical Specifications: Resistance: 100 Ohms Tolerance: ±5% Power (Watts): 0.1W, 1/10W Composition: Thick Film Features: Moisture Resistant Temperature Coefficient: ±100ppm/°C Operating Temperature: -55°C ~ 155°C Package / Case: 0603 (1608 Metric) Supplier Device Package: 0603 Size / Dimension: 0.063" L x 0.032" W (1.60mm x 0.80mm) Height - Seated (Max): 0.022" (0.55mm) Number of Terminations: 2 Datasheet(s): Thick Film Chip Resistor Intro <http://www.yageo.com.tw/exep/pages/download/literatures/PYu-R_INT-thick_7.pdf> Chip Resistor Marking <http://www.yageo.com/exep/pages/download/literatures/PYu-R_Marking_2.pdf> RC Series, L Datasheet <http://www.yageo.com/documents/recent/PYu-RC_Group_51_RoHS_L_8.pdf> Vendor(s): Digikey: 311-100GRCT-ND <https://www.digikey.com/product-detail/en/yageo/RC0603JR-07100RL/311-100GRCT-ND/729644>; POPULATE: YES; VERIFIED: NO
R86-R88 = openag-resistors:0OHM-RC0603JR-070RL: Yageo - RC0603JR-070RL - RES SMD 0 OHM JUMPER 1/10W 0603 Description: 0 Ohms Jumper 0.1W, 1/10W Chip Resistor 0603 (1608 Metric) Moisture Resistant Thick Film Technical Specifications: Resistance: 0 Ohms Power: 0.1W, 1/10W Operating Temperature: -55°C ~ 155°C Package / Case: 0603 (1608 Metric) Datasheet(s): RC Series, L Datasheet <http://www.yageo.com/documents/recent/PYu-RC_Group_51_RoHS_L_8.pdf> Vendor(s): Digikey: 311-0.0GRCT-ND <https://www.digikey.com/product-detail/en/yageo/RC0603JR-070RL/311-0.0GRCT-ND/729622>; POPULATE: YES; VERIFIED: NO
T1 = R-78E5.0-1.0:R-78E5.0-1.0: Non-Isolated DC/DC Converters 8-28Vin 5V 1.0A THRU <https://componentsearchengine.com/Images/1/R-78E5.0-1.0.jpg> Source: Datasheet <http://www.recom-power.com/pdf/Innoline/R-78Exx-1.0.pdf>; DESCRIPTION: Non-Isolated DC/DC Converters 8-28Vin 5V 1.0A THRU; HEIGHT: mm; MANUFACTURER_NAME: RECOM Power; MANUFACTURER_PART_NUMBER: R-78E5.0-1.0; RS_PART_NUMBER: 1446290; SUPPLIER_NAME: RS
U1 = OpenAG_I2C:TCA9548APWR; MANUFACTURER_PART_NUMBER: TCA9548APWR; VENDOR: TEXAS INSTRUMENTS
U2 = openag-microcontrollers:PHOTONH: PARTICLE - PHOTONH - Tiny Wi-Fi dev board w/cloud backend Description: The Photon is a $19 tiny Wi-Fi development kit for creating connected projects and products for the Internet of Things. It's easy to use, it's powerful, and it's connected to the cloud. Technical Specifications: Processor: STM32F205RGY6 120Mhz ARM Cortex M3 Wireless: 802.11b/g/n Wi-Fi Peripherals: Digital(x18), ADC(x8), DAC(x2), SPI(x2), I2S(x1), I2C(x1) SPI, CAN(1), USB(1), PWM(9) Memory: 1MB flash, 128KB RAM Cerfifications: FCC, CE and IC Operating Temperature: -20°C ~ 60°C Humidity Range: Non condensing, relative humidity: 95% Supply Input Voltage (VIN): 3.6V ~ 5.5V Supply Input Voltage (3V3): 3.0V ~ 3.6V Max Supply Output Current (VIN): 1A Max Supply Output Current (3V3): 100mA Average Operating Current (WiFi on, @VIN): up to 100mA Peak Operating Current (WiFi on, @VIN): up to 430mA I/O Max Source/Sink Current (Individual): 25mA I/O Max Source/Sinnk Current (Total): 120mA Datasheet(s): Photon Datasheet <https://docs.particle.io/datasheets/photon-datasheet/> Vendor(s): Particle: PHOTONH <https://store.particle.io/products/photon>; POPULATE: YES; VERIFIED: NO
U$1 = PJ-036ah:PJ-036AH
U$2 = SparkFun-Boards:BEAGLE_BONE_BLACK_CAPE

## Board
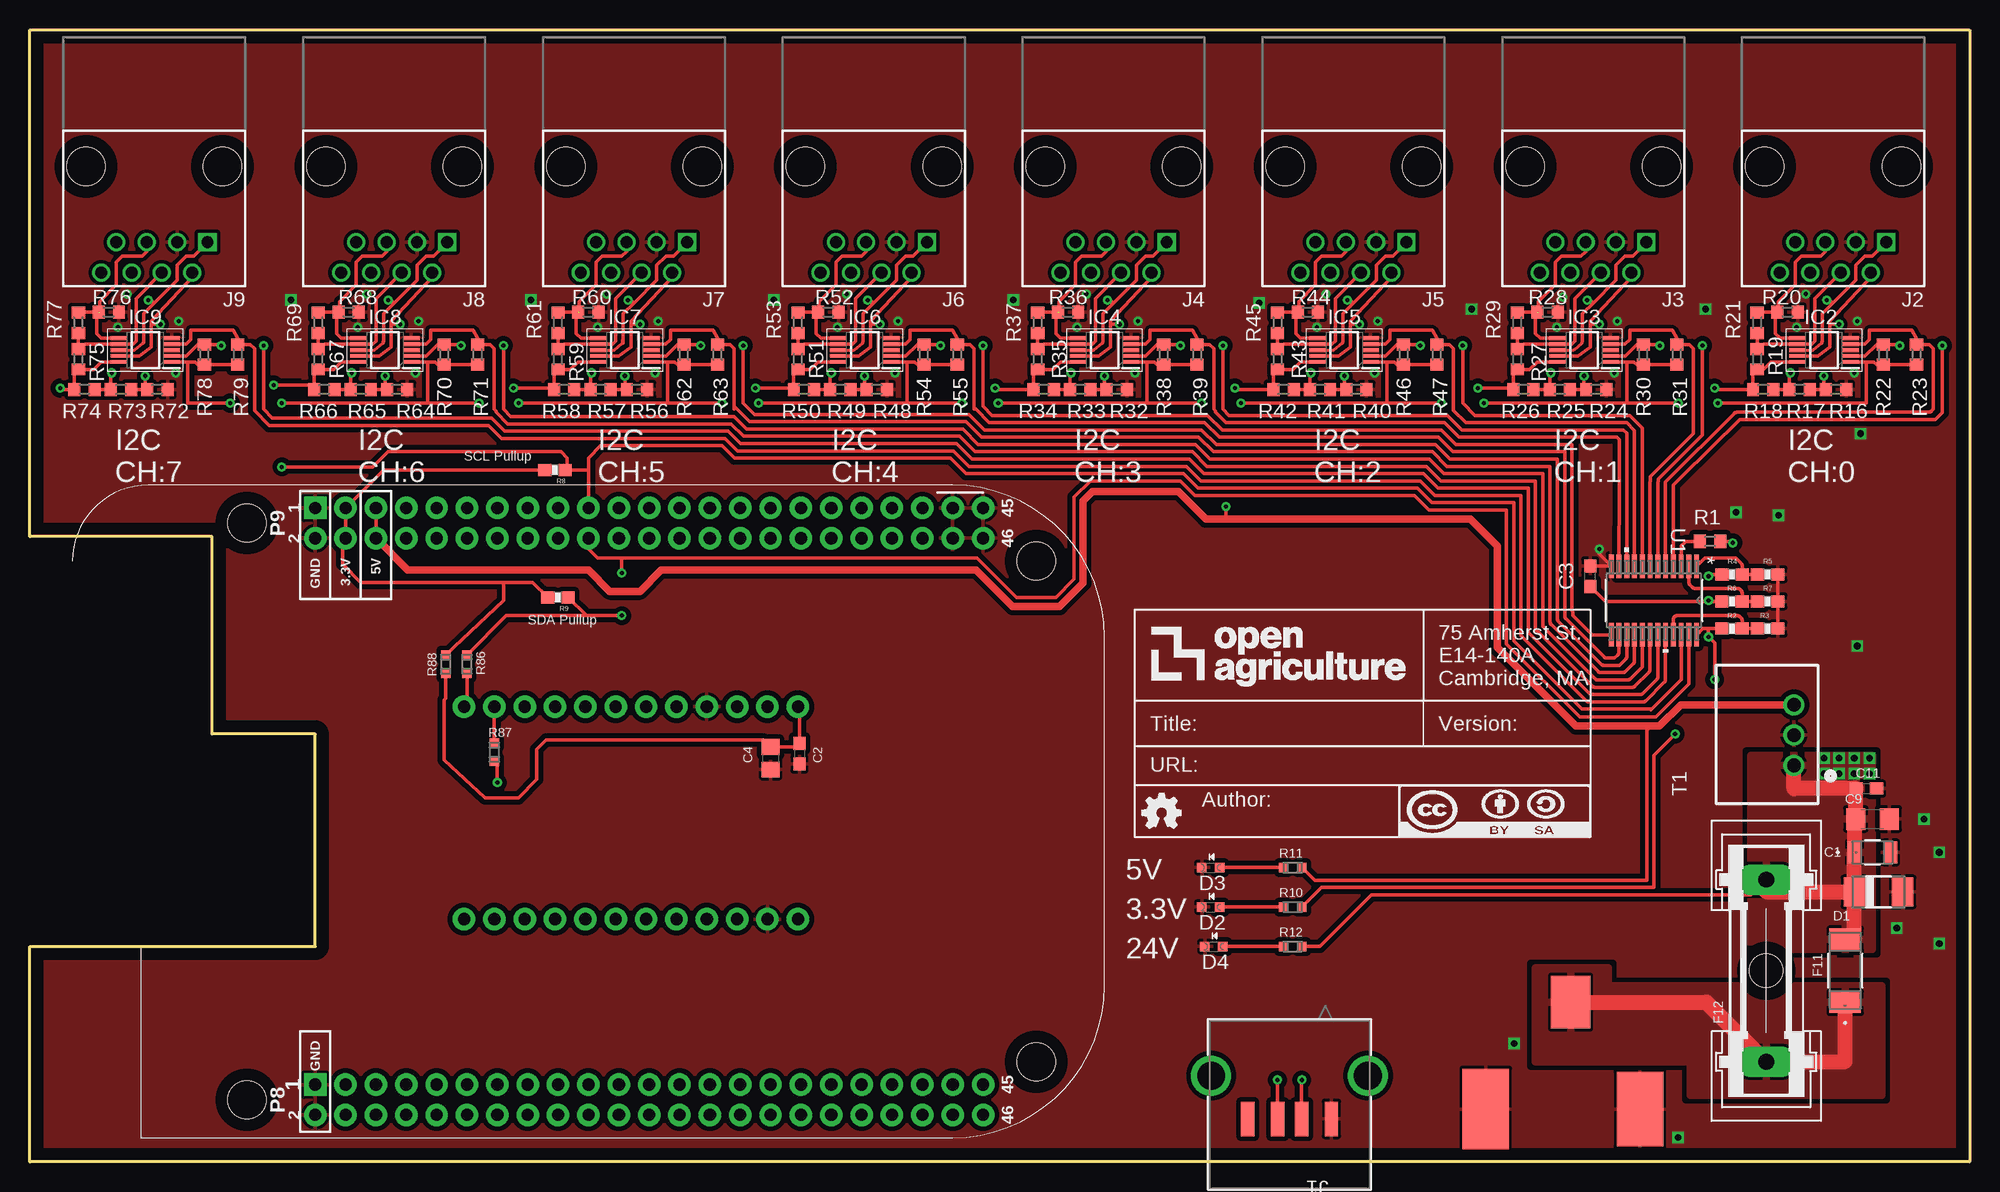
[diagram p5: board, top side]
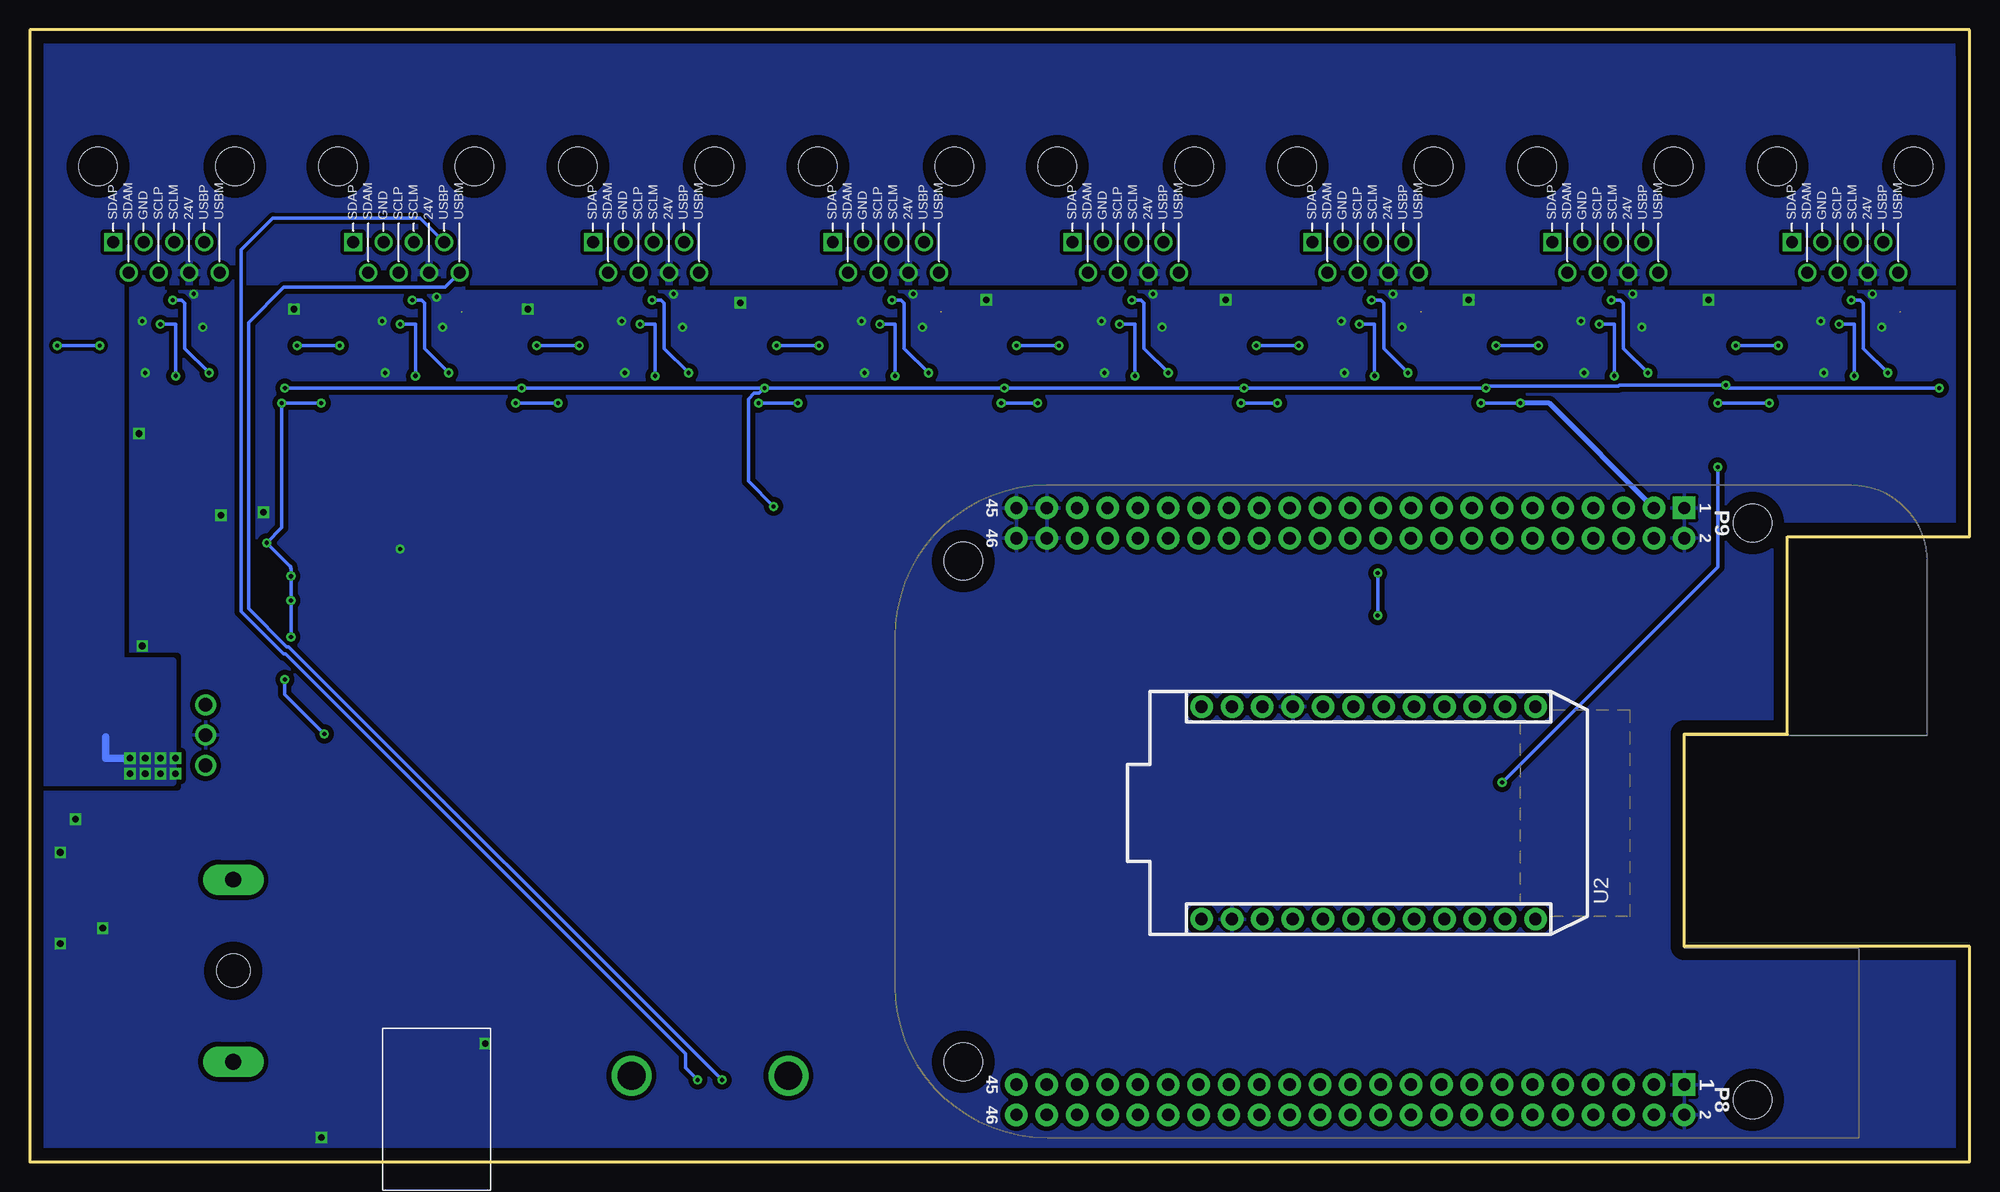
[diagram p6: board, bottom side, seen from below]

Size 162.31 x 94.74 mm. Coordinates in mm from the lower left corner, seen from the top.
Outline: 15.24,52.32 0,52.32 0,94.74 162.31,94.74 162.31,0 0,0 0,18.03 23.88,18.03 23.88,35.81 15.24,35.81 15.24,52.32
Copper layers (1*16): Top 0.035mm / dielectric 1.5mm / Bottom 0.035mm
Design rules "default *": minimum track width 6mil, minimum drill 0.35mm, track to track 12mil, track to pad 12mil, pad to pad 6mil, via to via 6mil, smd to smd 6mil, copper to edge 40mil, drill to drill 6mil, minimum pad ring 10mil, minimum via ring 8mil, stop-mask expansion 4mil, vias tented up to drill 25mil, thermal gap 10mil

### Footprints (pad centres in the part's own frame; a part is rotated, then mirrored left to right if it is on the bottom)
CAP_C1206 = smd 1.118 x 1.803: 1 -1.499,0; 2 1.499,0
C0603 = smd 1.1 x 1: 1 -0.85,0; 2 0.85,0
C0603@1 = smd 1.1 x 1: 1 -0.85,0; 2 0.85,0
C0805 = smd 1.3 x 1.5: 1 -0.95,0; 2 0.95,0
C1206 = smd 1.6 x 1.8: 1 -1.4,0; 2 1.4,0
DO-214AC = smd 1.8 x 2.4: A 2.025,0; C -2.025,0
CHIPLED_0603 = smd 0.8 x 0.8: A 0,-0.75; C 0,0.75
SS = smd 1.803 x 2.642: 1 -2.629,0; 2 2.629,0
GSH15 = drill 1.321 pad 2.54 long: 1 -7.62,0; 2 7.62,0 | hole 2.794: 0,0
SOP50P490X110-10N = smd 1.4 x 0.3: 1 -2.2,1; 2 -2.2,0.5; 3 -2.2,0; 4 -2.2,-0.5; 5 -2.2,-1; 6 2.2,-1; 7 2.2,-0.5; 8 2.2,0; 9 2.2,0.5; 10 2.2,1
CONN_USB-87583 = smd 1.12 x 2.88: 1 -3.492,1.221; 2 -0.992,1.221; 3 1.008,1.221; 4 3.508,1.221 | drill 2.311 pad 2.819: 6 -6.553,-2.388; 7 6.579,-2.388
OPENAG-V1-RJ45 = drill 1: 24V(6) 1.905,8.89; DSCLM(5) 0.635,6.35; DSCLP(4) -0.635,8.89; DSDAM(2) -3.175,8.89; GND(3) -1.905,6.35; USBM(8) 4.445,8.89; USBP(7) 3.175,6.35 | drill 1 square: DSDAP(1) -4.445,6.35 | hole 3.2: -5.715,0; 5.715,0
R0603 = smd 1 x 1.1: 1 -0.85,0; 2 0.85,0
0603-RES = smd 1.1 x 1: 1 -0.85,0; 2 0.85,0
RC0603N = smd 0.756 x 0.8: 1 -0.778,0; 2 0.778,0
R-78E5.0-1.0 = drill 1.15 pad 1.75: 1 3.21,2; 2 5.75,2; 3 8.29,2
PW24-M = smd 1.981 x 0.406: 1 -2.87,3.575; 2 -2.87,2.925; 3 -2.87,2.275; 4 -2.87,1.625; 5 -2.87,0.975; 6 -2.87,0.325; 7 -2.87,-0.325; 8 -2.87,-0.975; 9 -2.87,-1.625; 10 -2.87,-2.275; 11 -2.87,-2.925; 12 -2.87,-3.575; 13 2.87,-3.575; 14 2.87,-2.925; 15 2.87,-2.275; 16 2.87,-1.625; 17 2.87,-0.975; 18 2.87,-0.325; 19 2.87,0.325; 20 2.87,0.975; 21 2.87,1.625; 22 2.87,2.275; 23 2.87,2.925; 24 2.87,3.575
PHOTON = drill 1.016 pad 1.88: 1 1.27,32.258; 2 1.27,29.718; 3 1.27,27.178; 4 1.27,24.638; 5 1.27,22.098; 6 1.27,19.558; 7 1.27,17.018; 8 1.27,14.478; 9 1.27,11.938; 10 1.27,9.398; 11 1.27,6.858; 12 1.27,4.318; 13 19.05,4.318; 14 19.05,6.858; 15 19.05,9.398; 16 19.05,11.938; 17 19.05,14.478; 18 19.05,17.018; 19 19.05,19.558; 20 19.05,22.098; 21 19.05,24.638; 22 19.05,27.178; 23 19.05,29.718; 24 19.05,32.258
PJ-036AH = smd 4.4 x 3.3: 1 2.2,-0.65 | smd 6.75 x 3.9: 2 -6.75,6.45 | smd 6.2 x 3.9: 3 -6.75,-6.45
BEAGLE_BONE_BLACK_CAPE = drill 1.016 pad 1.88 square: P8.1 20.32,50.165; P9.1 20.32,1.905 | drill 1.016 pad 1.88: P8.2 20.32,52.705; P8.3 22.86,50.165; P8.4 22.86,52.705; P8.5 25.4,50.165; P8.6 25.4,52.705; P8.7 27.94,50.165; P8.8 27.94,52.705; P8.9 30.48,50.165; P8.10 30.48,52.705; P8.11 33.02,50.165; P8.12 33.02,52.705; P8.13 35.56,50.165; P8.14 35.56,52.705; P8.15 38.1,50.165; P8.16 38.1,52.705; P8.17 40.64,50.165; P8.18 40.64,52.705; P8.19 43.18,50.165; P8.20 43.18,52.705; P8.21 45.72,50.165; P8.22 45.72,52.705; P8.23 48.26,50.165; P8.24 48.26,52.705; P8.25 50.8,50.165; P8.26 50.8,52.705; P8.27 53.34,50.165; P8.28 53.34,52.705; P8.29 55.88,50.165; P8.30 55.88,52.705; P8.31 58.42,50.165; P8.32 58.42,52.705; P8.33 60.96,50.165; P8.34 60.96,52.705; P8.35 63.5,50.165; P8.36 63.5,52.705; P8.37 66.04,50.165; P8.38 66.04,52.705; P8.39 68.58,50.165; P8.40 68.58,52.705; P8.41 71.12,50.165; P8.42 71.12,52.705; P8.43 73.66,50.165; P8.44 73.66,52.705; P8.45 76.2,50.165; P8.46 76.2,52.705; P9.2 20.32,4.445; P9.3 22.86,1.905; P9.4 22.86,4.445; P9.5 25.4,1.905; P9.6 25.4,4.445; P9.7 27.94,1.905; P9.8 27.94,4.445; P9.9 30.48,1.905; P9.10 30.48,4.445; P9.11 33.02,1.905; P9.12 33.02,4.445; P9.13 35.56,1.905; P9.14 35.56,4.445; P9.15 38.1,1.905; P9.16 38.1,4.445; P9.17 40.64,1.905; P9.18 40.64,4.445; P9.19 43.18,1.905; P9.20 43.18,4.445; P9.21 45.72,1.905; P9.22 45.72,4.445; P9.23 48.26,1.905; P9.24 48.26,4.445; P9.25 50.8,1.905; P9.26 50.8,4.445; P9.27 53.34,1.905; P9.28 53.34,4.445; P9.29 55.88,1.905; P9.30 55.88,4.445; P9.31 58.42,1.905; P9.32 58.42,4.445; P9.33 60.96,1.905; P9.34 60.96,4.445; P9.35 63.5,1.905; P9.36 63.5,4.445; P9.37 66.04,1.905; P9.38 66.04,4.445; P9.39 68.58,1.905; P9.40 68.58,4.445; P9.41 71.12,1.905; P9.42 71.12,4.445; P9.43 73.66,1.905; P9.44 73.66,4.445; P9.45 76.2,1.905; P9.46 76.2,4.445 | hole 3.175: 14.605,3.175; 80.645,6.35; 80.645,48.26; 14.605,51.435

### Placement (x,y rotation side)
ATTRIBUTES  92.46,27.18 0 top
C1  154.18,25.91 0 top
C2  64.39,34.16 270 top
C3  130.56,49.02 90 top
C4  61.98,33.78 270 top
C9  154.18,28.7 0 top
C11  153.67,31.24 0 top
D1  154.69,22.61 0 top
D2  98.81,21.34 90 top
D3  98.81,24.64 90 top
D4  99.06,18.03 90 top
F11  151.89,16 90 top
F12  145.29,16 90 top
IC2  150.11,67.94 180 top
IC3  130.05,67.94 180 top
IC4  89.92,67.94 180 top
IC5  109.98,67.94 180 top
IC6  69.85,67.94 180 top
IC7  49.78,67.94 180 top
IC8  29.72,67.94 180 top
IC9  9.65,67.94 180 top
J1  105.41,4.83 180 top
J2  150.88,83.31 180 top
J3  130.81,83.31 180 top
J4  90.68,83.31 180 top
J5  110.74,83.31 180 top
J6  70.61,83.31 180 top
J7  50.55,83.31 180 top
J8  30.48,83.31 180 top
J9  10.41,83.31 180 top
R1  140.59,51.94 0 top
R2  142.42,44.63 180 top
R3  145.41,44.63 180 top
R4  142.44,49.17 180 top
R5  145.41,49.17 180 top
R6  142.42,46.91 180 top
R7  145.41,46.91 180 top
R8  43.94,57.91 180 top
R9  44.2,47.24 180 top
R10  105.66,21.34 0 top
R11  105.66,24.64 0 top
R12  105.66,18.03 0 top
R16  151.13,64.64 0 top
R17  148.08,64.64 0 top
R18  145.03,64.64 0 top
R19  144.53,67.18 270 top
R20  147.07,71.12 180 top
R21  144.53,70.23 270 top
R22  155.07,67.56 270 top
R23  157.86,67.56 270 top
R24  131.06,64.64 0 top
R25  128.02,64.64 0 top
R26  124.97,64.64 0 top
R27  124.46,67.18 270 top
R28  127,71.12 180 top
R29  124.46,70.23 270 top
R30  135,67.56 270 top
R31  137.79,67.56 270 top
R32  90.93,64.64 0 top
R33  87.88,64.64 0 top
R34  84.84,64.64 0 top
R35  84.33,67.18 270 top
R36  86.87,71.12 180 top
R37  84.33,70.23 270 top
R38  94.87,67.56 270 top
R39  97.66,67.56 270 top
R40  111,64.64 0 top
R41  107.95,64.64 0 top
R42  104.9,64.64 0 top
R43  104.39,67.18 270 top
R44  106.93,71.12 180 top
R45  104.39,70.23 270 top
R46  114.94,67.56 270 top
R47  117.73,67.56 270 top
R48  70.87,64.64 0 top
R49  67.82,64.64 0 top
R50  64.77,64.64 0 top
R51  64.26,67.18 270 top
R52  66.8,71.12 180 top
R53  64.26,70.23 270 top
R54  74.8,67.56 270 top
R55  77.6,67.56 270 top
R56  50.8,64.64 0 top
R57  47.75,64.64 0 top
R58  44.7,64.64 0 top
R59  44.2,67.18 270 top
R60  46.74,71.12 180 top
R61  44.2,70.23 270 top
R62  54.74,67.56 270 top
R63  57.53,67.56 270 top
R64  30.73,64.64 0 top
R65  27.69,64.64 0 top
R66  24.64,64.64 0 top
R67  24.13,67.18 270 top
R68  26.67,71.12 180 top
R69  24.13,70.23 270 top
R70  34.67,67.56 270 top
R71  37.47,67.56 270 top
R72  10.67,64.64 0 top
R73  7.62,64.64 0 top
R74  4.57,64.64 0 top
R75  4.06,67.18 270 top
R76  6.6,71.12 180 top
R77  4.06,70.23 270 top
R78  14.61,67.56 270 top
R79  17.4,67.56 270 top
R86  36.58,41.66 90 top
R87  38.86,34.29 270 top
R88  34.8,41.66 90 top
T1  149.61,29.97 90 top
U1  135.89,46.99 270 top
U2  32,19.05 90 bottom
U$1  128.27,11.18 90 top
U$2  3.56,56.64 180 bottom

### Tracks (layer width: path | path; a pad name or v marks a point on that pad's centre or on a via)
24V_IN
  Top 1.27: F11.1 151.89,8.38 F12.1 140.29,13.38 U$1.1
  pour Top (isolate 0.406): 125.98,16.26 125.98,8.38 138.94,8.38 138.94,5.59 154.94,5.59 154.94,14.73 132.08,14.73 132.08,16.26
+3V3  (via drill 0.35)
  Top 0.305: U1.24 139.97,44.63 140.46,44.63 | 140.46,44.63 R2.2 | R6.2 140.54,46.91 | 140.54,46.91 v140.46,46.99 | 140.46,44.63 v140.46,43.94 140.97,43.43 v140.97,40.39 | R4.2 140.61,49.17 v140.46,49.02 | R1.2 142.37,51.94 v142.49,51.82 | C3.1 131.81,46.91 140.54,46.91 | IC2.1 153.67,66.94 | 153.67,66.94 154.29,66.94 154.52,66.71 R22.2 R23.2 | 153.67,66.94 153.67,63.5 v141.22,63.5 | IC3.1 133.6,66.94 | 133.6,66.94 134.22,66.94 134.45,66.71 R30.2 R31.2 | 133.6,63.5 133.6,66.94 | IC5.1 113.54,66.94 | 113.54,66.94 114.16,66.94 114.39,66.71 R46.2 R47.2 | 113.54,63.5 113.54,66.94 | IC4.1 93.47,66.94 | 93.47,66.94 94.09,66.94 94.32,66.71 R38.2 R39.2 | 93.47,63.5 93.47,66.94 | IC6.1 73.41,66.94 | 73.41,66.94 74.03,66.94 74.26,66.71 R54.2 R55.2 | 73.41,63.5 73.41,66.94 | IC7.1 53.34,66.94 | 53.34,66.94 53.96,66.94 54.19,66.71 R62.2 R63.2 | 53.34,63.5 53.34,66.94 | IC8.1 33.27,66.94 | 33.27,66.94 33.89,66.94 34.12,66.71 R70.2 R71.2 | 33.27,63.5 33.27,66.94 | IC9.1 13.21,66.94 | 13.21,66.94 13.83,66.94 14.06,66.71 R78.2 R79.2 | 13.21,66.94 13.21,63.5 v16.76,63.5 | v21.08,63.5 33.27,63.5 | 33.27,63.5 v37.59,63.5 | v40.89,63.5 53.34,63.5 | 53.34,63.5 v57.91,63.5 | v60.96,63.5 73.41,63.5 | 73.41,63.5 v77.98,63.5 | v81.03,63.5 93.47,63.5 | 93.47,63.5 v98.04,63.5 | v101.35,63.5 113.54,63.5 | 113.54,63.5 v118.11,63.5 | v121.67,63.5 133.6,63.5 | 133.6,63.5 v137.92,63.5 | R9.2 42.08,48.51 39.62,48.51 | 39.62,48.51 27.69,48.51 26.16,50.04 26.16,51.94 U$2.P9.4 U$2.P9.3 29.59,57.91 R8.2 | R10.2 108.07,22.96 135.89,22.96 135.89,34.04 v137.67,35.81 | R88.2 39.62,47.01 39.62,48.51
  Bottom 0.305: v140.46,43.94 v140.46,46.99 v140.46,49.02 140.46,49.65 arc-45 140.56,49.88 v142.49,51.82 141.22,53.09 v141.22,63.5 v137.92,63.5 | v16.76,63.5 v21.08,63.5 | v37.59,63.5 v40.89,63.5 | v57.91,63.5 v60.96,63.5 | v77.98,63.5 v81.03,63.5 | v98.04,63.5 v101.35,63.5 | v118.11,63.5 v121.67,63.5 | v137.67,35.81 140.97,39.12 v140.97,40.39
  Bottom 0.406: U$2.P9.3 35.18,63.5 v37.59,63.5
+5V  (via drill 0.35)
  Top 0.305: IC2.10 145.69,66.94 145.03,66.29 144.56,66.29 | 144.56,66.29 R19.2 | 144.56,66.29 144.18,65.91 R18.1 141.1,64.64 v140.97,64.77 | IC3.10 126.13,66.94 125.48,66.29 124.5,66.29 | 124.5,66.29 R27.2 | 124.5,66.29 124.12,65.91 R26.1 123.99,64.77 v121.16,64.77 | IC5.10 106.31,66.94 105.66,66.29 104.43,66.29 | 104.43,66.29 R43.2 | 104.43,66.29 104.05,65.91 R42.1 100.97,64.64 v100.84,64.77 | IC4.10 86.25,66.94 85.6,66.29 84.37,66.29 | 84.37,66.29 R35.2 | 84.37,66.29 83.99,65.91 R34.1 80.9,64.64 v80.77,64.77 | IC6.10 65.93,66.94 65.28,66.29 64.3,66.29 | 64.3,66.29 R51.2 | 64.3,66.29 63.92,65.91 R50.1 63.79,64.77 v60.71,64.77 | IC7.10 45.86,66.94 45.21,66.29 44.23,66.29 | 44.23,66.29 R59.2 | R58.1 43.85,64.77 | 43.85,64.77 43.85,65.91 44.23,66.29 | IC8.10 26.05,66.94 25.4,66.29 24.17,66.29 | 24.17,66.29 R67.2 | 24.17,66.29 23.79,65.91 R66.1 23.41,65.02 v20.39,65.02 | IC9.10 5.99,66.94 5.33,66.29 4.1,66.29 | 4.1,66.29 R75.2 | 4.1,66.29 3.72,65.91 R74.1 2.67,64.64 v2.54,64.77 | v40.46,64.77 43.85,64.77 | v100.08,54.86 100.08,53.8 | U$2.P9.6 U$2.P9.5 | R11.2 107.51,23.57 135.28,23.57 135.28,36.12 135.64,36.47
  Top 0.61: U$2.P9.6 31.62,49.53 46.74,49.53 48.51,47.75 51.05,47.75 52.83,49.53 79.19,49.53 82.23,46.48 86.17,46.48 88.14,48.45 88.14,55.31 88.93,56.1 96.1,56.1 98.4,53.8 100.08,53.8 120.55,53.8 122.78,51.56 122.78,43.05 129.36,36.47 135.64,36.47 136.36,36.47 138.15,38.26 T1.3
  Bottom 0.305: v2.54,64.77 20.14,64.77 v20.39,65.02 29.3,65.02 29.37,64.95 40.28,64.95 v40.46,64.77 v60.71,64.77 v80.77,64.77 v100.84,64.77 | v100.84,64.77 v121.16,64.77 v140.97,64.77 | v100.84,64.77 101.27,64.33 101.69,64.33 102.18,63.85 102.18,56.97 v100.08,54.86
+24V  (via drill 0.55)
  Top 0.305: R12.2 107.95,18.03 112.27,22.35 144.02,22.35 F12.2
  Top 1.27: F12.2 145.29,22.61 D1.C | F11.2 152.66,18.63 D1.C | D1.C 152.66,25.91 C1.1 152.68,28.7 C9.1 152.78,31.24 C11.1 147.61,31.24 T1.1
  Bottom 0.61: v153.92,33.78 155.96,33.78 155.96,35.56
  other vias: 152.65,33.78 151.38,33.78 150.11,33.78 153.92,32.51 152.65,32.51 151.38,32.51 150.11,32.51
  pour Top (isolate 0.406): 154.18,17.78 154.18,34.04 146.56,34.04 144.02,34.04 144.02,17.78
  pour Bottom (isolate 0.254): 162.05,31.75 150.37,31.75 150.37,41.91 154.69,41.91 154.69,73.66 1.02,73.66 1.52,95.25 162.31,95.25 161.8,33.53
A0_EXT_1
  Top 0.305: R5.2 R4.1 143.29,49.87 arc45 143.2,50.09 142.84,50.45 arc45 142.62,50.55 140.15,50.55 U1.1
A1_EXT_1
  Top 0.305: R7.2 R6.1 143.27,47.61 arc45 143.18,47.83 143.09,47.91 arc45 142.87,48.01 139.32,48.01 arc-45 139.1,48.1 138.91,48.29 arc-45 138.81,48.52 U1.2
A2_EXT_1
  Top 0.305: R3.2 R2.1 143.27,45.32 arc45 143.18,45.55 143.09,45.63 arc45 142.87,45.72 137.83,45.72 arc90 137.51,45.4 U1.21
DSCLM0
  Top 0.305: R21.1 144.56,71.12 145.8,71.12 146.05,71.12 | IC2.6 146.45,68.94 146.05,69.34 146.05,71.12 | J2.DSCLM(5) 150.24,76.2 149.86,75.82 148.21,75.82 147.7,75.31 147.7,73.41 146.3,72.01 146.3,71.12 R20.2 146.05,71.12
DSCLM1  (1 unrouted)
  Top 0.305: R29.1 124.5,71.12 125.98,71.12 | 125.98,71.12 R28.2 | IC3.6 126.38,68.94 125.98,69.34 125.98,71.12 | 126.24,71.12 126.24,72.01 127.64,73.41 127.64,75.31 128.14,75.82 129.79,75.82 130.18,76.2 J3.DSCLM(5)
DSCLM2
  Top 0.305: R45.1 104.43,71.12 105.92,71.12 | 105.92,71.12 R44.2 106.17,71.12 106.17,72.01 107.57,73.41 107.57,75.31 108.08,75.82 109.73,75.82 110.11,76.2 J5.DSCLM(5) | IC5.6 106.31,68.94 105.92,69.34 105.92,71.12
DSCLM3  (1 unrouted)
  Top 0.305: R37.1 84.37,71.12 85.85,71.12 | 85.85,71.12 R36.2 | IC4.6 86.25,68.94 85.85,69.34 85.85,71.12 | 86.11,71.12 86.11,72.01 87.5,73.41 87.5,75.31 88.01,75.82 89.66,75.82 90.04,76.2 J4.DSCLM(5)
DSCLM4
  Top 0.305: R53.1 64.3,71.12 65.79,71.12 | IC6.6 66.18,68.94 65.79,69.34 65.79,71.12 | J6.DSCLM(5) 69.98,76.2 69.6,75.82 67.94,75.82 67.44,75.31 67.44,73.41 66.04,72.01 66.04,71.12 R52.2 65.79,71.12
DSCLM5  (1 unrouted)
  Top 0.305: R61.1 44.23,71.12 45.72,71.12 | 45.72,71.12 R60.2 | IC7.6 46.12,68.94 45.72,69.34 45.72,71.12 | 45.97,71.12 45.97,72.01 47.37,73.41 47.37,75.31 47.88,75.82 49.53,75.82 49.91,76.2 J7.DSCLM(5)
DSCLM6
  Top 0.305: R69.1 24.17,71.12 25.65,71.12 | 25.65,71.12 R68.2 25.91,71.12 25.91,72.01 27.3,73.41 27.3,75.31 27.81,75.82 29.46,75.82 29.84,76.2 J8.DSCLM(5) | IC8.6 26.05,68.94 25.65,69.34 25.65,71.12
DSCLM7  (1 unrouted)
  Top 0.305: R77.1 4.1,71.12 5.59,71.12 | 5.59,71.12 R76.2 | IC9.6 5.99,68.94 5.59,69.34 5.59,71.12 | 5.84,71.12 5.84,72.01 7.24,73.41 7.24,75.31 7.75,75.82 9.4,75.82 9.78,76.2 J9.DSCLM(5)
DSCLP0
  Top 0.305: R21.2 R19.1 145.07,68.45 145.54,68.45 145.68,68.44 IC2.7 149.09,68.44 149.35,68.71 149.35,72.26 J2.DSCLP(4)
DSCLP1
  Top 0.305: R29.2 R27.1 125.01,68.45 125.48,68.45 125.61,68.44 IC3.7 129.02,68.44 129.29,68.71 129.29,72.26 J3.DSCLP(4)
DSCLP2
  Top 0.305: R45.2 R43.1 104.94,68.45 105.41,68.45 105.55,68.44 IC5.7 108.96,68.44 109.22,68.71 109.22,72.26 J5.DSCLP(4)
DSCLP3
  Top 0.305: R37.2 R35.1 84.88,68.45 85.34,68.45 85.48,68.44 IC4.7 88.89,68.44 89.15,68.71 89.15,72.26 J4.DSCLP(4)
DSCLP4
  Top 0.305: R53.2 R51.1 64.81,68.45 65.28,68.45 65.41,68.44 IC6.7 68.83,68.44 69.09,68.71 69.09,72.26 J6.DSCLP(4)
DSCLP5
  Top 0.305: R61.2 R59.1 44.74,68.45 45.21,68.45 45.35,68.44 IC7.7 48.76,68.44 49.02,68.71 49.02,72.26 J7.DSCLP(4)
DSCLP6
  Top 0.305: R69.2 R67.1 24.68,68.45 25.15,68.45 25.28,68.44 IC8.7 28.69,68.44 28.96,68.71 28.96,72.26 J8.DSCLP(4)
DSCLP7
  Top 0.305: R77.2 R75.1 4.61,68.45 5.08,68.45 5.21,68.44 IC9.7 8.63,68.44 8.89,68.71 8.89,72.26 J9.DSCLP(4)
DSDAM0  (via drill 0.35)
  Top 0.305: J2.DSDAM(2) 154.05,74.04 150.62,70.36 150.62,70.1 | IC2.9 147.92,67.44 149.61,67.44 150.62,68.2 150.62,70.1 | R17.2 R16.1 arc-90 150.11,64.81 v150.11,65.79 150.11,65.91 | v151.38,70.1 150.62,70.1
  Bottom 0.305: v150.11,65.79 150.11,70.1 v151.38,70.1
DSDAM1  (via drill 0.35)
  Top 0.305: J3.DSDAM(2) 133.99,74.04 130.56,70.36 130.56,70.1 | IC3.9 129.54,67.44 130.56,68.2 130.56,70.1 | R25.2 R24.1 arc-90 130.05,64.81 v130.05,65.79 130.05,65.91 | v131.32,70.1 130.56,70.1
  Bottom 0.305: v130.05,65.79 130.05,70.1 v131.32,70.1
DSDAM2  (via drill 0.35)
  Top 0.305: J5.DSDAM(2) 113.92,74.04 110.49,70.36 110.49,70.1 | IC5.9 109.47,67.44 110.49,68.2 110.49,70.1 | R41.2 R40.1 arc-90 109.98,64.81 v109.98,65.79 109.98,65.91 | v111.25,70.1 110.49,70.1
  Bottom 0.305: v109.98,65.79 109.98,70.1 v111.25,70.1
DSDAM3  (via drill 0.35)
  Top 0.305: J4.DSDAM(2) 93.85,74.04 90.42,70.36 90.42,70.1 | IC4.9 89.41,67.44 90.42,68.2 90.42,70.1 | R33.2 R32.1 arc-90 89.92,64.81 v89.92,65.79 89.92,65.91 | v91.19,70.1 90.42,70.1
  Bottom 0.305: v89.92,65.79 89.92,70.1 v91.19,70.1
DSDAM4  (via drill 0.35)
  Top 0.305: J6.DSDAM(2) 73.79,74.04 70.36,70.36 70.36,70.1 | IC6.9 69.34,67.44 70.36,68.2 70.36,70.1 | R49.2 R48.1 arc-90 69.85,64.81 v69.85,65.79 69.85,65.91 | v71.12,70.1 70.36,70.1
  Bottom 0.305: v69.85,65.79 69.85,70.1 v71.12,70.1
DSDAM5  (via drill 0.35)
  Top 0.305: J7.DSDAM(2) 53.72,74.04 50.29,70.36 50.29,70.1 | IC7.9 47.59,67.44 49.28,67.44 50.29,68.2 50.29,70.1 | R57.2 R56.1 arc-90 49.78,64.81 v49.78,65.79 49.78,65.91 | v51.05,70.1 50.29,70.1
  Bottom 0.305: v49.78,65.79 49.78,70.1 v51.05,70.1
DSDAM6  (via drill 0.35)
  Top 0.305: J8.DSDAM(2) 33.66,74.04 30.23,70.36 30.23,70.1 | IC8.9 29.21,67.44 30.23,68.2 30.23,70.1 | R65.2 R64.1 arc-90 29.72,64.81 v29.72,65.79 29.72,65.91 | v30.99,70.1 30.23,70.1
  Bottom 0.305: v29.72,65.79 29.72,70.1 v30.99,70.1
DSDAM7  (via drill 0.35)
  Top 0.305: J9.DSDAM(2) 13.59,74.04 10.16,70.36 10.16,70.1 | IC9.9 9.14,67.44 10.16,68.2 10.16,70.1 | R73.2 R72.1 arc-90 9.65,64.81 v9.65,65.79 9.65,65.91 | v10.92,70.1 10.16,70.1
  Bottom 0.305: v9.65,65.79 9.65,70.1 v10.92,70.1
DSDAP0  (via drill 0.35)
  Top 0.254: IC2.8 149.24,67.94 149.94,68.52
  Top 0.305: R18.2 R17.1 147.23,65.95 v147.32,66.04 | 149.94,68.53 149.99,68.71 | 149.99,68.71 149.99,70.99 150.88,71.88 | 150.88,71.88 152.78,73.79 152.78,75.06 153.54,75.82 154.18,75.82 J2.DSDAP(1) | v150.37,72.14 150.62,72.14 150.88,71.88 | 149.94,68.52 149.94,68.66 149.99,68.71
  Bottom 0.305: v147.32,66.04 149.35,68.07 149.35,71.88 149.61,72.14 v150.37,72.14
DSDAP1  (via drill 0.35)
  Top 0.254: IC3.8 129.17,67.94 129.87,68.52
  Top 0.305: R26.2 R25.1 127.17,65.95 v127.25,66.04 | 130.81,71.88 129.92,70.99 129.92,68.71 129.87,68.53 129.87,68.52 | 130.81,71.88 132.72,73.79 132.72,75.06 133.48,75.82 134.11,75.82 J3.DSDAP(1) | v130.3,72.14 130.56,72.14 130.81,71.88
  Bottom 0.305: v127.25,66.04 129.29,68.07 129.29,71.88 129.54,72.14 v130.3,72.14
DSDAP2  (via drill 0.35)
  Top 0.254: IC5.8 109.11,67.94 109.8,68.52
  Top 0.305: R42.2 R41.1 107.1,65.95 v107.19,66.04 | 110.74,71.88 109.86,70.99 109.86,68.71 109.8,68.53 109.8,68.52 | 110.74,71.88 112.65,73.79 112.65,75.06 113.41,75.82 114.05,75.82 J5.DSDAP(1) | v110.24,72.14 110.49,72.14 110.74,71.88
  Bottom 0.305: v107.19,66.04 109.22,68.07 109.22,71.88 109.47,72.14 v110.24,72.14
DSDAP3  (via drill 0.35)
  Top 0.254: IC4.8 89.04,67.94 89.74,68.52
  Top 0.305: R34.2 R33.1 87.03,65.95 v87.12,66.04 | 90.68,71.88 89.79,70.99 89.79,68.71 89.74,68.53 89.74,68.52 | 90.68,71.88 92.58,73.79 92.58,75.06 93.34,75.82 93.98,75.82 J4.DSDAP(1) | v90.17,72.14 90.42,72.14 90.68,71.88
  Bottom 0.305: v87.12,66.04 89.15,68.07 89.15,71.88 89.41,72.14 v90.17,72.14
DSDAP4  (via drill 0.35)
  Top 0.254: IC6.8 68.97,67.94 69.67,68.52
  Top 0.305: R50.2 R49.1 66.97,65.95 v67.06,66.04 | 70.61,71.88 69.72,70.99 69.72,68.71 69.67,68.53 69.67,68.52 | 70.61,71.88 72.52,73.79 72.52,75.06 73.28,75.82 73.91,75.82 J6.DSDAP(1) | v70.1,72.14 70.36,72.14 70.61,71.88
  Bottom 0.305: v67.06,66.04 69.09,68.07 69.09,71.88 69.34,72.14 v70.1,72.14
DSDAP5  (via drill 0.35)
  Top 0.254: IC7.8 48.91,67.94 49.61,68.52
  Top 0.305: R58.2 R57.1 46.9,65.95 v46.99,66.04 | 50.55,71.88 49.66,70.99 49.66,68.83 | 50.55,71.88 52.45,73.79 52.45,75.06 53.21,75.82 53.85,75.82 J7.DSDAP(1) | v50.04,72.14 50.29,72.14 50.55,71.88 | 49.63,68.52 49.63,68.56 49.66,68.58 49.66,68.83 | 49.61,68.52 49.61,68.78 49.66,68.83
  Bottom 0.305: v46.99,66.04 49.02,68.07 49.02,71.88 49.28,72.14 v50.04,72.14
DSDAP6  (via drill 0.35)
  Top 0.254: IC8.8 28.84,67.94 29.54,68.52
  Top 0.305: R66.2 R65.1 26.84,65.95 v26.92,66.04 | 29.54,68.53 29.59,68.71 | 29.59,68.71 29.59,70.99 30.48,71.88 | 30.48,71.88 32.38,73.79 32.38,75.06 33.15,75.82 33.78,75.82 J8.DSDAP(1) | v29.97,72.14 30.23,72.14 30.48,71.88 | 29.54,68.52 29.54,68.66 29.59,68.71
  Bottom 0.305: v26.92,66.04 28.96,68.07 28.96,71.88 29.21,72.14 v29.97,72.14
DSDAP7  (via drill 0.35)
  Top 0.254: IC9.8 8.78,67.94 9.47,68.52
  Top 0.305: R74.2 R73.1 6.77,65.95 v6.86,66.04 | 9.53,68.71 9.47,68.53 9.53,68.58 | 10.41,71.88 9.53,70.99 9.53,68.71 | 10.41,71.88 12.32,73.79 12.32,75.06 13.08,75.82 13.72,75.82 J9.DSDAP(1) | v9.91,72.14 10.16,72.14 10.41,71.88 | 9.53,68.58 9.53,68.71 | 9.47,68.52 9.53,68.57 9.53,68.58
  Bottom 0.305: v6.86,66.04 8.89,68.07 8.89,71.88 9.14,72.14 v9.91,72.14
GND  (via drill 0.35, 0.55)
  Top 0.305: C3.2 132.3,49.87 U1.12 131.32,50.86 v131.32,51.31 | R5.1 R7.1 R3.1
  other vias: 152.91,70.36 152.65,66.04 147.83,69.85 148.59,72.64 132.84,70.36 132.59,66.04 127.76,69.85 128.27,72.39 112.78,70.36 112.52,66.04 107.7,69.85 108.46,72.64 92.71,70.36 92.46,66.04 87.63,69.85 88.39,72.64 72.64,70.36 72.39,66.04 67.56,69.85 68.33,72.64 52.58,70.36 52.32,66.04 47.5,69.85 48.26,72.64 32.51,70.36 32.26,66.04 27.43,69.85 28.19,72.64 12.45,70.36 12.19,66.04 7.37,69.85 8.13,72.64 158.5,28.7 159.77,25.91 156.21,19.56 159.77,18.29 137.92,2.03 124.21,9.91 152.91,43.18 142.75,54.36 153.16,60.96 120.65,71.37 140.21,71.37 102.87,71.88 82.3,72.14 62.23,72.14 41.91,72.14 21.84,72.14 146.3,54.1
  pour Top (isolate 0.305): 143.26,94.74 143.26,63.25 159,63.25 159,94.74
  pour Top (isolate 0.305): 123.19,94.74 123.19,63.25 138.94,63.25 138.94,94.74
  pour Top (isolate 0.305): 103.12,94.74 103.12,63.25 118.87,63.25 118.87,94.74
  pour Top (isolate 0.305): 83.06,94.74 83.06,63.25 98.81,63.25 98.81,94.74
  pour Top (isolate 0.305): 62.99,94.74 62.99,63.25 78.74,63.25 78.74,94.74
  pour Top (isolate 0.305): 42.93,94.74 42.93,63.25 58.67,63.25 58.67,94.74
  pour Top (isolate 0.305): 22.86,94.74 22.86,63.25 38.61,63.25 38.61,94.74
  pour Top (isolate 0.305): 2.79,94.74 2.79,63.25 18.54,63.25 18.54,94.74
  pour Top (isolate 0.406, rank 2): -0.25,95 162.31,95 162.31,0 0,0 0,42.42
  pour Bottom (isolate 0.406, rank 2): 0,95 162.31,95 162.31,0 0,0 0,76.71
N$2
  Top 0.305: R11.1 D3.A
N$4
  Top 0.305: R12.1 D4.A
N$9
  Top 0.305: R88.1 34.8,38.81 34.67,38.68 34.67,33.66 38.1,30.48 40.89,30.48 42.42,32 42.42,34.54 43.18,35.31 61.4,35.31 C4.1 64.11,34.73 C2.1 64.39,37.21 64.26,37.34 U2.24
N$12
  Top 0.305: R10.1 D2.A
PHOTON_SCL
  Top 0.305: R87.1 U2.14
PHOTON_SDA
  Top 0.305: U2.13 36.58,38.35 R86.1
RESET1
  Top 0.305: R1.1 138.69,51.94 arc45 138.46,51.85 138.26,51.64 arc45 138.16,51.42 U1.3
SC0
  Top 0.305: U1.5 136.87,56.9 142.61,62.65 arc-45 142.84,62.74 158.87,62.74 arc45 159.1,62.83 159.26,62.99 159.26,68.07 158.92,68.41 R23.1 157.86,68.96 157.48,69.6 153.92,69.6 153.92,68.83 153.53,68.44 IC2.4
SC1
  Top 0.305: U1.7 135.56,56.9 135.6,56.94 135.6,57.36 139.19,60.95 139.19,68.07 138.85,68.41 R31.1 137.79,68.96 137.41,69.6 133.86,69.6 133.86,68.83 133.47,68.44 IC3.4
SC2
  Top 0.305: IC5.4 113.4,68.44 113.79,68.83 113.79,69.6 117.35,69.6 117.73,68.96 R47.1 118.78,68.41 119.13,68.07 119.13,62.89 120.14,61.87 133.6,61.87 134.26,61.21 U1.9
SC3
  Top 0.305: 132.99,56.74 132.99,56.64 | 132.99,56.64 U1.11 | IC4.4 93.34,68.44 93.73,68.83 93.73,69.6 97.28,69.6 97.66,68.96 R39.1 98.72,68.41 99.06,68.07 99.06,62.99 99.21,62.84 99.21,62.74 100.08,61.87 118.36,61.87 119.58,60.66 132.8,60.66 133,60.45 133,58.27 132.99,56.64
SC4
  Top 0.305: U1.14 132.97,42.67 arc-45 132.87,42.45 132.59,42.16 131.96,42.16 arc-45 131.73,42.26 128.51,45.48 arc-45 128.42,45.7 128.42,59.44 119.08,59.44 117.86,60.66 99.52,60.66 98.3,61.87 80.27,61.87 79.15,62.99 78.99,62.99 78.99,68.07 78.65,68.41 R55.1 77.6,68.96 77.22,69.6 73.66,69.6 73.66,68.83 73.27,68.44 IC6.4
SC5
  Top 0.305: U1.16 134.26,41.94 arc-45 134.17,41.72 133.49,41.04 arc-45 133.27,40.95 131.45,40.95 arc-45 131.23,41.04 127.3,44.97 arc-45 127.2,45.19 127.2,58.22 118.58,58.22 117.36,59.44 99.01,59.44 97.79,60.66 79.61,60.66 78.31,61.95 60.22,61.95 58.93,63.25 | IC7.4 53.2,68.44 53.59,68.83 53.59,69.6 57.15,69.6 57.53,68.96 R63.1 58.59,68.41 58.93,68.07 58.93,63.25 | 58.93,63.25 58.93,62.99
SC6
  Top 0.305: U1.18 135.56,41.21 arc-45 135.47,40.98 134.31,39.82 arc-45 134.08,39.73 130.95,39.73 arc-45 130.72,39.82 126.08,44.47 arc-45 125.98,44.69 125.98,57 118.07,57 116.85,58.22 98.51,58.22 97.29,59.44 79.1,59.44 77.81,60.73 59.72,60.73 58.68,61.77 39.98,61.77 39.01,62.74 39.01,62.84 38.86,62.99 38.86,68.07 38.52,68.41 R71.1 37.47,68.96 37.08,69.6 33.53,69.6 33.53,68.83 33.14,68.44 IC8.4
SC7
  Top 0.305: U1.20 136.87,40.38 arc-45 136.77,40.15 135.22,38.6 arc-45 135,38.51 130.44,38.51 arc-45 130.22,38.6 124.86,43.96 arc-45 124.77,44.18 124.77,55.78 117.56,55.78 116.34,57 98,57 96.78,58.22 78.6,58.22 77.3,59.51 59.21,59.51 58.17,60.55 39.48,60.55 38.38,61.65 20.04,61.65 18.8,62.89 18.8,68.07 18.45,68.41 R79.1 17.4,68.96 17.02,69.6 13.46,69.6 13.46,68.83 13.07,68.44 IC9.4
SCL  (via drill 0.35)
  Top 0.305: U1.22 138.16,40.38 135.64,37.85 135.59,37.9 129.88,37.9 124.16,43.62 124.16,55.17 117.31,55.17 116.09,56.39 97.75,56.39 96.53,57.61 78.34,57.61 77.05,58.9 58.96,58.9 57.92,59.94 47.75,59.94 46.74,58.93 46.74,57.91 | 46.74,57.91 U$2.P9.19 | R8.1 44.96,57.91 | 44.96,57.91 46.74,57.91 | R87.2 39.12,33.26 v39.12,31.75 | v21.08,58.17 28.7,58.17 29.97,59.44 44.45,59.44 44.96,58.93 44.96,57.91
  Bottom 0.305: v39.12,31.75 21.08,49.78 v21.08,58.17
SD0  (via drill 0.35)
  Top 0.305: U1.4 137.51,56.64 138.18,57.31 143.06,62.11 143.33,62.11 143.27,62.13 159.44,62.13 160.02,62.71 v160.02,68.33 | IC2.2 153.55,67.44 154.52,68.41 R22.1 156.38,68.41 v156.46,68.33
  Bottom 0.305: v156.46,68.33 v160.02,68.33
SD1  (via drill 0.35)
  Top 0.305: U1.6 136.22,56.9 136.25,56.94 136.25,57.15 139.95,60.85 v139.95,68.33 | IC3.2 133.49,67.44 134.45,68.41 R30.1 136.31,68.41 v136.4,68.33
  Bottom 0.305: v136.4,68.33 v139.95,68.33
SD2  (via drill 0.35)
  Top 0.305: IC5.2 113.42,67.44 114.39,68.41 R46.1 116.24,68.41 v116.33,68.33 | v119.89,68.33 119.89,63.5 120.9,62.48 133.86,62.48 134.91,61.43 U1.8
  Bottom 0.305: v116.33,68.33 v119.89,68.33
SD3  (via drill 0.35)
  Top 0.305: U1.10 133.62,56.79 | 133.62,56.79 133.6,55.63 | IC4.2 93.35,67.44 94.32,68.41 R38.1 96.18,68.41 v96.27,68.33 | v99.82,68.33 99.82,62.99 100.33,62.48 118.62,62.48 119.84,61.27 133.35,61.27 133.62,61 133.62,56.79
  Bottom 0.305: v96.27,68.33 v99.82,68.33
SD4  (via drill 0.35)
  Top 0.305: IC6.2 73.29,67.44 74.26,68.41 R54.1 76.11,68.41 v76.2,68.33 | v79.76,68.33 79.76,63.25 80.52,62.48 98.55,62.48 99.77,61.27 118.11,61.27 119.33,60.05 129.03,60.05 129.03,46.13 129.12,46.04 129.12,45.73 130.73,44.12 131.83,44.12 U1.13
  Bottom 0.305: v76.2,68.33 v79.76,68.33
SD5  (via drill 0.35)
  Top 0.305: U1.15 133.62,42.31 arc-45 133.52,42.08 132.99,41.55 131.71,41.55 arc-45 131.48,41.65 127.91,45.22 arc-45 127.81,45.45 127.81,58.83 118.83,58.83 117.61,60.05 99.27,60.05 98.05,61.27 79.86,61.27 78.56,62.56 60.63,62.56 59.69,63.5 v59.69,68.33 | IC7.2 53.22,67.44 54.19,68.41 R62.1 56.05,68.41 v56.13,68.33
  Bottom 0.305: v56.13,68.33 v59.69,68.33
SD6  (via drill 0.35)
  Top 0.305: U1.17 134.91,41.44 133.9,40.43 arc-45 133.68,40.34 131.2,40.34 arc-45 130.97,40.43 126.69,44.72 arc-45 126.59,44.94 126.59,57.61 118.32,57.61 117.1,58.83 98.76,58.83 97.54,60.05 79.35,60.05 78.06,61.34 59.97,61.34 58.93,62.38 40.23,62.38 39.62,62.99 v39.62,68.33 | IC8.2 33.16,67.44 34.12,68.41 R70.1 35.98,68.41 v36.07,68.33
  Bottom 0.305: v36.07,68.33 v39.62,68.33
SD7  (via drill 0.35)
  Top 0.305: U1.19 136.22,40.59 arc-45 136.12,40.36 134.97,39.21 arc-45 134.74,39.12 130.69,39.12 arc-45 130.47,39.21 125.47,44.21 arc-45 125.37,44.44 125.37,56.39 117.82,56.39 116.6,57.61 98.26,57.61 97.04,58.83 78.85,58.83 77.55,60.12 59.47,60.12 58.42,61.16 39.73,61.16 38.63,62.26 20.29,62.26 19.56,62.99 v19.56,68.33 | IC9.2 13.09,67.44 14.06,68.41 R78.1 15.91,68.41 v16,68.33
  Bottom 0.305: v16,68.33 v19.56,68.33
SDA  (via drill 0.35)
  Top 0.305: U1.23 138.81,40.01 136.04,37.24 129.67,37.24 123.55,43.37 123.55,54.56 117.06,54.56 115.84,55.78 97.5,55.78 96.28,57 88.75,57 87.38,55.63 87.38,48.77 85.85,47.24 82.55,47.24 79.25,50.55 49.53,50.55 | 49.53,50.55 47.5,50.55 46.74,51.31 U$2.P9.20 | R9.1 46.57,45.72 | 46.57,45.72 46.74,45.72 v49.53,45.72 | v49.53,49.28 49.53,50.55 | R86.2 39.86,45.72 46.57,45.72
  Bottom 0.305: v49.53,45.72 v49.53,49.28
USBM1  (via drill 0.35)
  Top 0.305: J1.3 104.4,6.85 v104.39,6.86
  Bottom 0.305: J3.USBM(8) 127.56,73.22 141.05,73.22 144.02,70.26 144.02,46.32 140.81,43.11 140.64,43.11 v104.39,6.86
USBP1  (via drill 0.35)
  Top 0.305: J1.2 106.4,6.83 v106.43,6.86
  Bottom 0.305: J3.USBP(7) 129.67,78.99 141.99,78.99 144.63,76.35 144.63,46.06 141.06,42.5 140.9,42.5 107.44,9.04 107.44,7.87 v106.43,6.86

### Text on the board
tPlace: GND | 3.3V | 5V | 5V | 3.3V | 24V | GND
tNames: SCL Pullup | I2C / CH:7 | I2C / CH:6 | I2C / CH:5 | I2C / CH:4 | I2C / CH:3 | I2C / CH:2 | I2C / CH:1 | I2C / CH:0 | SDA Pullup